# EAGLE design dash-hat (EAGLE 7.7.0)
Assembly variants: Rev A Final Assembly
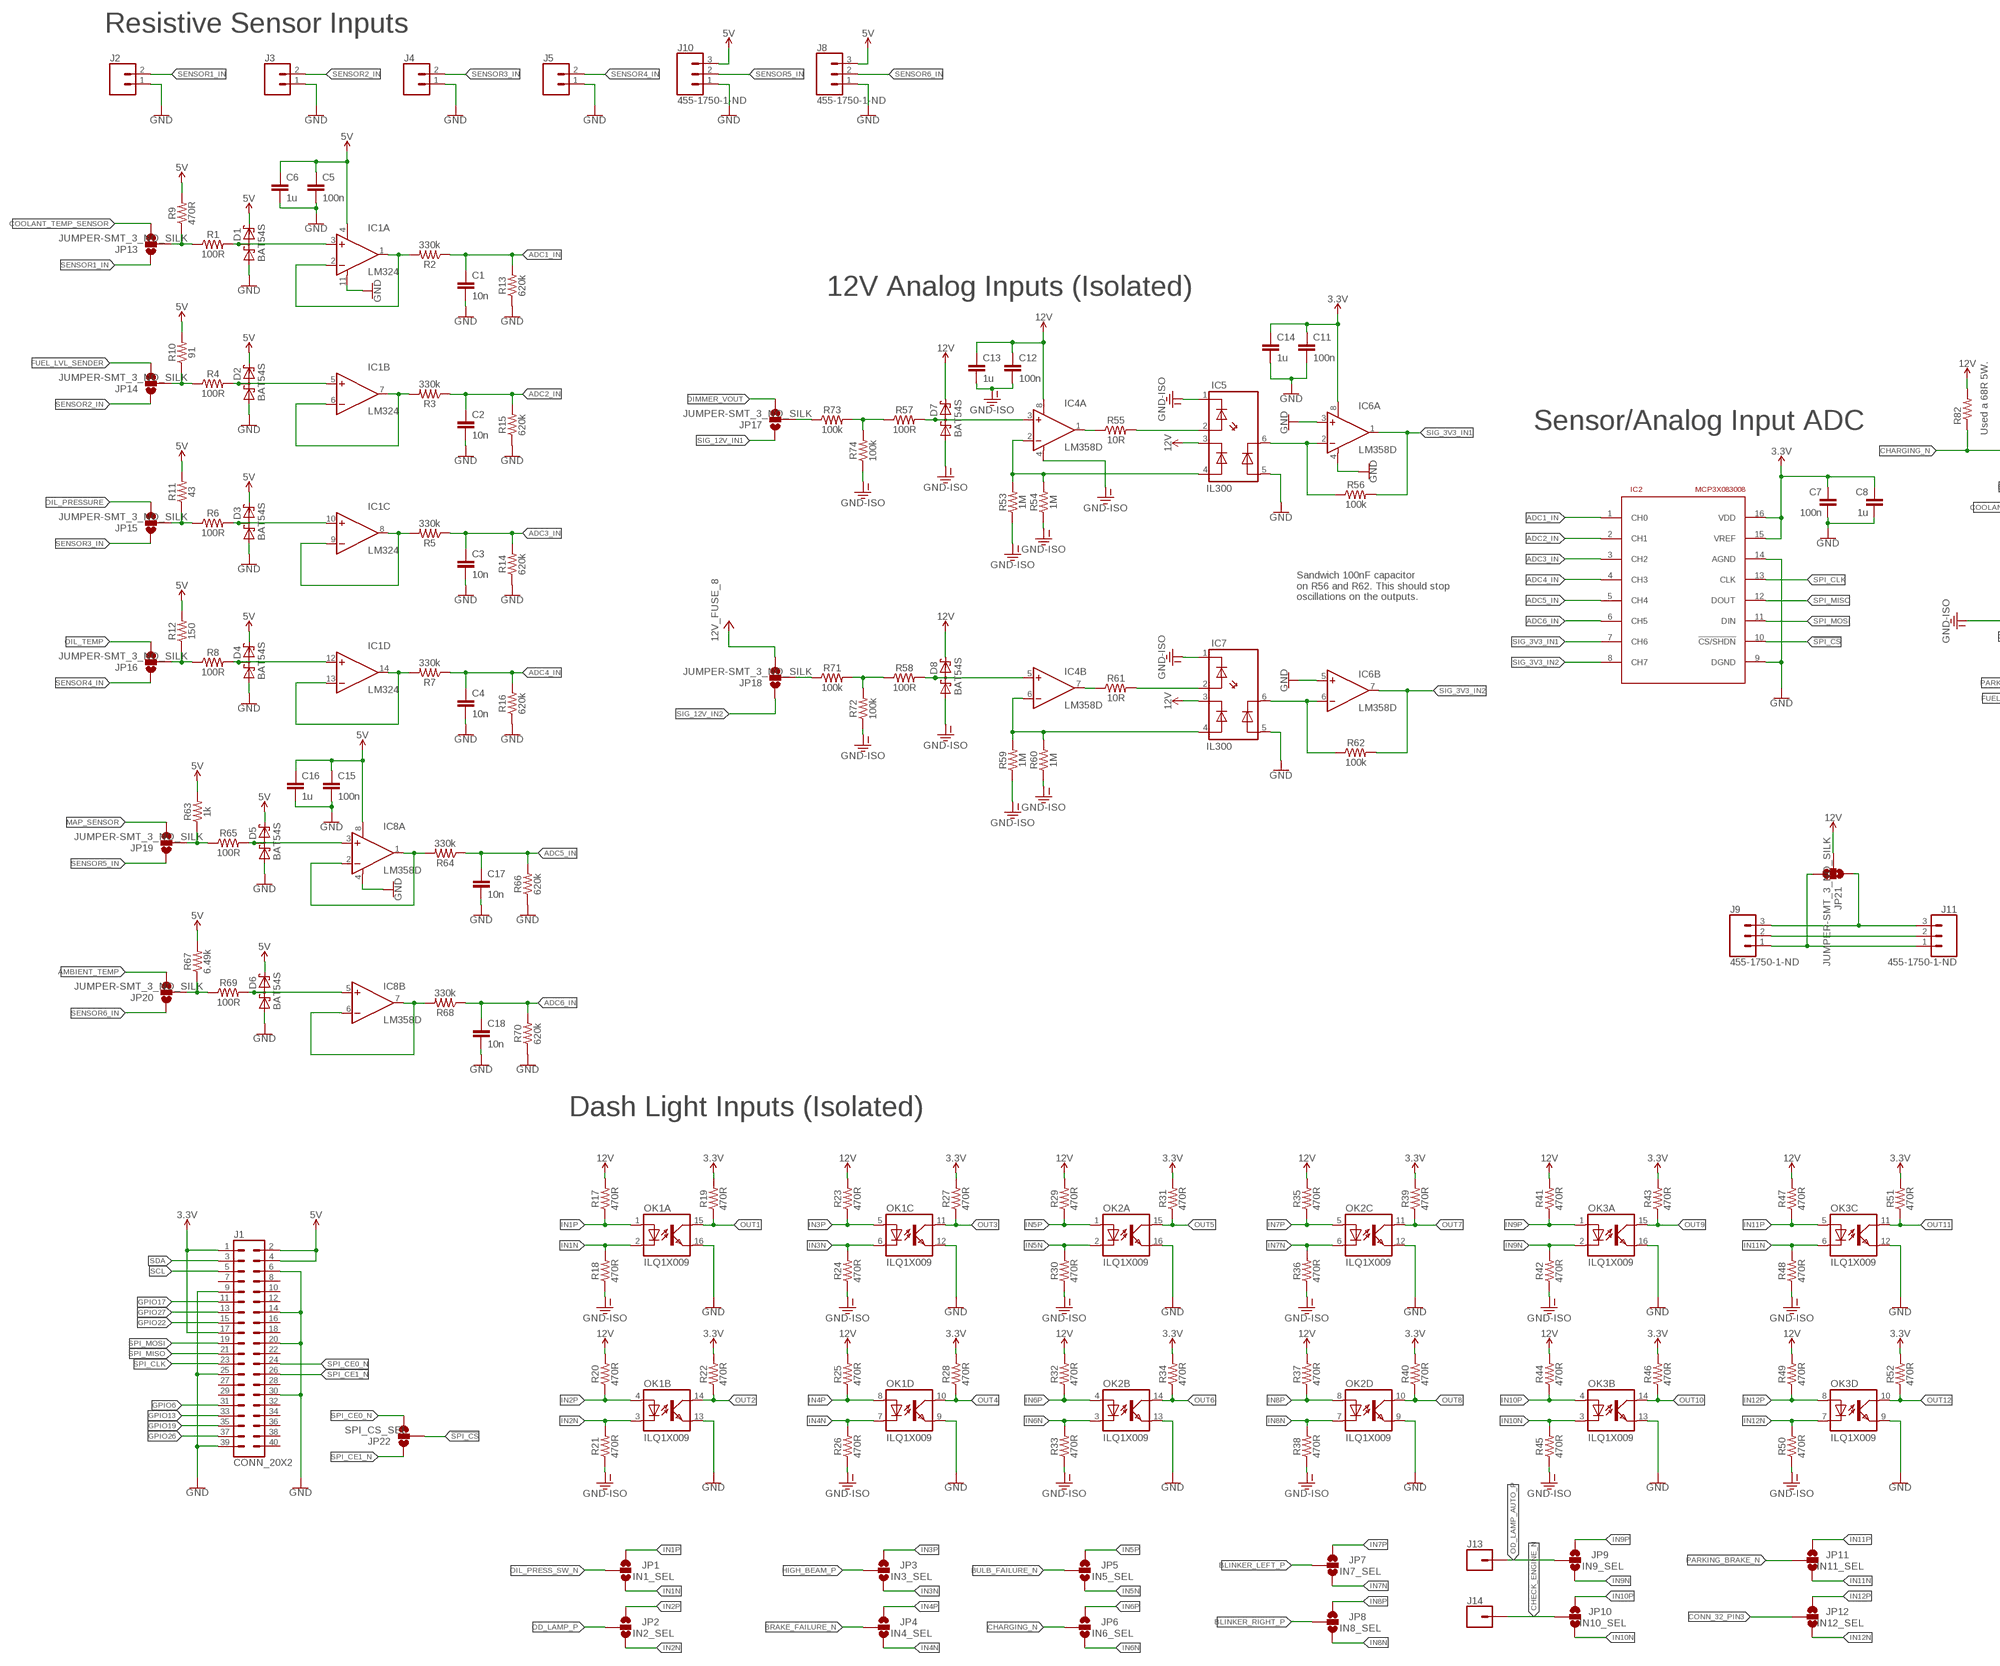
[diagram p0: schematic, sheet 1, part 1 of 2]
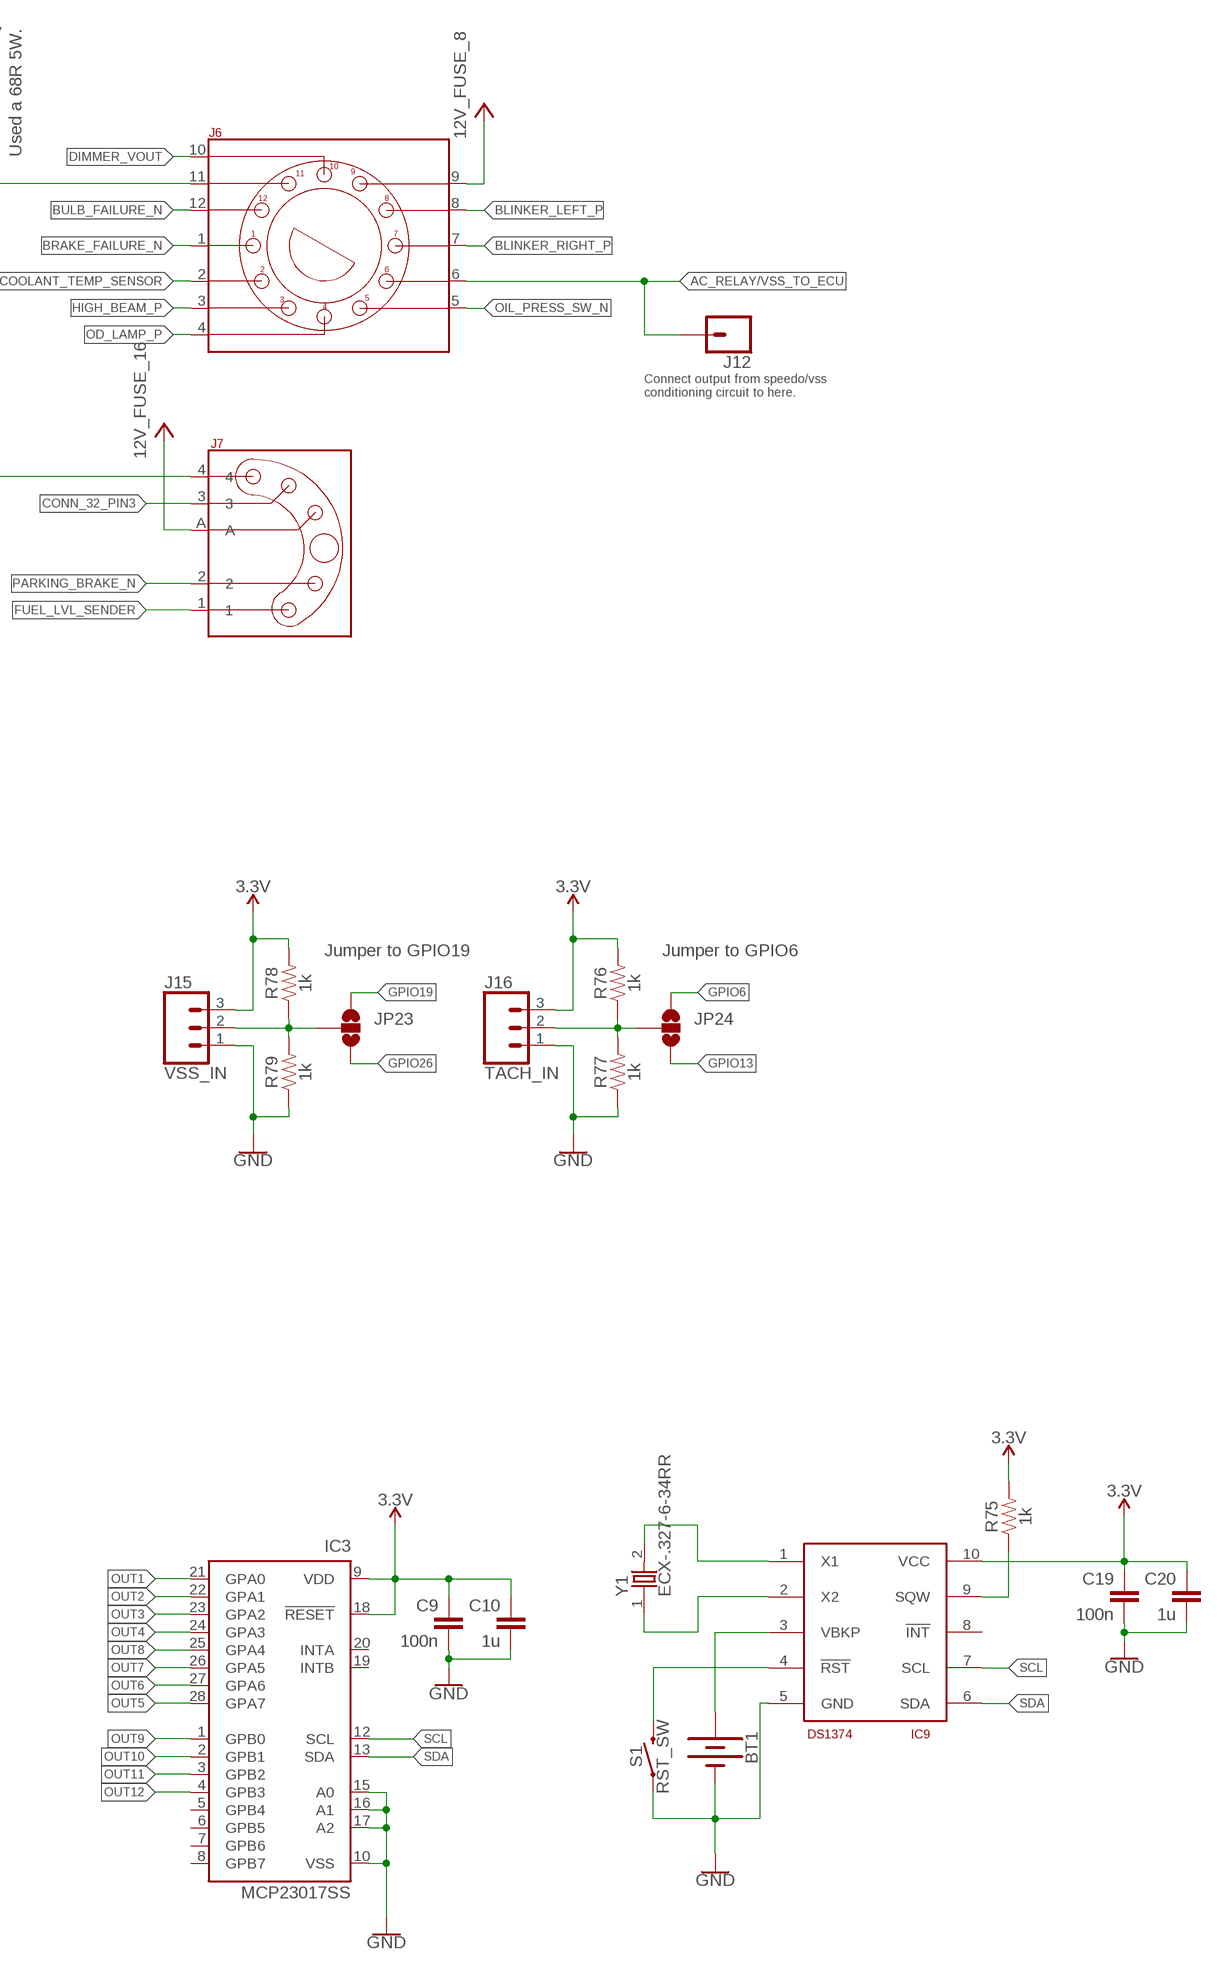
[diagram p1: schematic, sheet 1, part 2 of 2]

## Parts
BT1  BATTERY-12MM_SMD  [BATTCON_12MM]
C1  10n  CL10B103KB8NNNC  [0603]
C2  10n  CL10B103KB8NNNC  [0603]
C3  10n  CL10B103KB8NNNC  [0603]
C4  10n  CL10B103KB8NNNC  [0603]
C5  100n  CL10B104MB8NNNC  [0603]
C6  1u  CL10A105KA8NNNC  [0603]
C7  100n  CL10B104MB8NNNC  [0603]
C8  1u  CL10A105KA8NNNC  [0603]
C9  100n  CL10B104MB8NNNC  [0603]
C10  1u  CL10A105KA8NNNC  [0603]
C11  100n  CL10B104MB8NNNC  [0603]
C12  100n  CL10B104MB8NNNC  [0603]
C13  1u  CL10A105KA8NNNC  [0603]
C14  1u  CL10A105KA8NNNC  [0603]
C15  100n  CL10B104MB8NNNC  [0603]
C16  1u  CL10A105KA8NNNC  [0603]
C17  10n  CL10B103KB8NNNC  [0603]
C18  10n  CL10B103KB8NNNC  [0603]
C19  100n  CL10B104MB8NNNC  [0603]
C20  1u  CL10A105KA8NNNC  [0603]
D1  BAT54S  [SOT23]
D2  BAT54S  [SOT23]
D3  BAT54S  [SOT23]
D4  BAT54S  [SOT23]
D5  BAT54S  [SOT23]
D6  BAT54S  [SOT23]
D7  BAT54S  [SOT23]
D8  BAT54S  [SOT23]
IC1  LM324  [TSSOP14]
IC2  MCP3X083008  [SO16]
IC3  MCP23017SS  [SSOP28]
IC4  LM358D  [SO08]
IC5  IL300  [DIL8-SMD]
IC6  LM358D  [SO08]
IC7  IL300  [DIL8-SMD]
IC8  LM358D  [SO08]
IC9  DS1374  [UMAX10]
J1  CONN_20X2  [2X20]
J2  CONN_02  [1X02]
J3  CONN_02  [1X02]
J4  CONN_02  [1X02]
J5  CONN_02  [1X02]
J6  VOLVO_CONN_31  [VOLVO_CON_31]
J7  VOLVO_CONN_32  [VOLVO_CON_32]
J8  455-1750-1-ND  CONN_03  [1X03]
J9  455-1750-1-ND  CONN_03  [1X03]
J10  455-1750-1-ND  CONN_03  [1X03]
J11  455-1750-1-ND  CONN_03  [1X03]
J12  CONN_01OFFSET  [1X01_OFFSET]
J13  CONN_01PTH_2MM  [1X01_2MM]
J14  CONN_01PTH_2MM  [1X01_2MM]
J15  VSS_IN  CONN_03  [1X03]
J16  TACH_IN  CONN_03  [1X03]
JP1  IN1_SEL  JUMPER-SMT_3_NO_SILK  [SMT-JUMPER_3_NO_SILK]
JP2  IN2_SEL  JUMPER-SMT_3_NO_SILK  [SMT-JUMPER_3_NO_SILK]
JP3  IN3_SEL  JUMPER-SMT_3_NO_SILK  [SMT-JUMPER_3_NO_SILK]
JP4  IN4_SEL  JUMPER-SMT_3_NO_SILK  [SMT-JUMPER_3_NO_SILK]
JP5  IN5_SEL  JUMPER-SMT_3_NO_SILK  [SMT-JUMPER_3_NO_SILK]
JP6  IN6_SEL  JUMPER-SMT_3_NO_SILK  [SMT-JUMPER_3_NO_SILK]
JP7  IN7_SEL  JUMPER-SMT_3_NO_SILK  [SMT-JUMPER_3_NO_SILK]
JP8  IN8_SEL  JUMPER-SMT_3_NO_SILK  [SMT-JUMPER_3_NO_SILK]
JP9  IN9_SEL  JUMPER-SMT_3_NO_SILK  [SMT-JUMPER_3_NO_SILK]
JP10  IN10_SEL  JUMPER-SMT_3_NO_SILK  [SMT-JUMPER_3_NO_SILK]
JP11  IN11_SEL  JUMPER-SMT_3_NO_SILK  [SMT-JUMPER_3_NO_SILK]
JP12  IN12_SEL  JUMPER-SMT_3_NO_SILK  [SMT-JUMPER_3_NO_SILK]
JP13  JUMPER-SMT_3_NO_SILK  [SMT-JUMPER_3_NO_SILK]
JP14  JUMPER-SMT_3_NO_SILK  [SMT-JUMPER_3_NO_SILK]
JP15  JUMPER-SMT_3_NO_SILK  [SMT-JUMPER_3_NO_SILK]
JP16  JUMPER-SMT_3_NO_SILK  [SMT-JUMPER_3_NO_SILK]
JP17  JUMPER-SMT_3_NO_SILK  [SMT-JUMPER_3_NO_SILK]
JP18  JUMPER-SMT_3_NO_SILK  [SMT-JUMPER_3_NO_SILK]
JP19  JUMPER-SMT_3_NO_SILK  [SMT-JUMPER_3_NO_SILK]
JP20  JUMPER-SMT_3_NO_SILK  [SMT-JUMPER_3_NO_SILK]
JP21  JUMPER-SMT_3_NO_SILK  [SMT-JUMPER_3_NO_SILK]
JP22  SPI_CS_SEL  JUMPER-SMT_3_NO_SILK  [SMT-JUMPER_3_NO_SILK]
JP23  TACH_INPUT_SEL  JUMPER-SMT_3_NO_SILK  [SMT-JUMPER_3_NO_SILK]
JP24  TACH_INPUT_SEL  JUMPER-SMT_3_NO_SILK  [SMT-JUMPER_3_NO_SILK]
OK1  ILQ1X009  [SMD16]
OK2  ILQ1X009  [SMD16]
OK3  ILQ1X009  [SMD16]
R1  100R  RC0603JR-07100RL  [0603]
R2  330k  RC0603JR-07330KL  [0603]
R3  330k  RC0603JR-07330KL  [0603]
R4  100R  RC0603JR-07100RL  [0603]
R5  330k  RC0603JR-07330KL  [0603]
R6  100R  RC0603JR-07100RL  [0603]
R7  330k  RC0603JR-07330KL  [0603]
R8  100R  RC0603JR-07100RL  [0603]
R9  470R  RC0603JR-07470RL  [0603]
R10  91  RC0603JR-071KL  [0603]
R11  43  RC0603JR-071KL  [0603]
R12  150  RC0603JR-071KL  [0603]
R13  620k  RC0603JR-07620KL  [0603]
R14  620k  RC0603JR-07620KL  [0603]
R15  620k  RC0603JR-07620KL  [0603]
R16  620k  RC0603JR-07620KL  [0603]
R17  470R  RC0603JR-07470RL  [0603]
R18  470R  RC0603JR-07470RL  [0603]  (not fitted in variant Rev A Final Assembly)
R19  470R  RC0603JR-07470RL  [0603]
R20  470R  RC0603JR-07470RL  [0603]  (not fitted in variant Rev A Final Assembly)
R21  470R  RC0603JR-07470RL  [0603]
R22  470R  RC0603JR-07470RL  [0603]
R23  470R  RC0603JR-07470RL  [0603]  (not fitted in variant Rev A Final Assembly)
R24  470R  RC0603JR-07470RL  [0603]
R25  470R  RC0603JR-07470RL  [0603]
R26  470R  RC0603JR-07470RL  [0603]  (not fitted in variant Rev A Final Assembly)
R27  470R  RC0603JR-07470RL  [0603]
R28  470R  RC0603JR-07470RL  [0603]
R29  470R  RC0603JR-07470RL  [0603]
R30  470R  RC0603JR-07470RL  [0603]  (not fitted in variant Rev A Final Assembly)
R31  470R  RC0603JR-07470RL  [0603]
R32  470R  RC0603JR-07470RL  [0603]
R33  470R  RC0603JR-07470RL  [0603]  (not fitted in variant Rev A Final Assembly)
R34  470R  RC0603JR-07470RL  [0603]
R35  470R  RC0603JR-07470RL  [0603]  (not fitted in variant Rev A Final Assembly)
R36  470R  RC0603JR-07470RL  [0603]
R37  470R  RC0603JR-07470RL  [0603]  (not fitted in variant Rev A Final Assembly)
R38  470R  RC0603JR-07470RL  [0603]
R39  470R  RC0603JR-07470RL  [0603]
R40  470R  RC0603JR-07470RL  [0603]
R41  470R  RC0603JR-07470RL  [0603]
R42  470R  RC0603JR-07470RL  [0603]
R43  470R  RC0603JR-07470RL  [0603]
R44  470R  RC0603JR-07470RL  [0603]
R45  470R  RC0603JR-07470RL  [0603]  (not fitted in variant Rev A Final Assembly)
R46  470R  RC0603JR-07470RL  [0603]
R47  470R  RC0603JR-07470RL  [0603]
R48  470R  RC0603JR-07470RL  [0603]  (not fitted in variant Rev A Final Assembly)
R49  470R  RC0603JR-07470RL  [0603]
R50  470R  RC0603JR-07470RL  [0603]
R51  470R  RC0603JR-07470RL  [0603]
R52  470R  RC0603JR-07470RL  [0603]
R53  1M  RC0603JR-071ML  [0603]
R54  1M  RC0603JR-071ML  [0603]
R55  10R  RC0603JR-1310RL  [0603]
R56  100k  RC0603JR-07100KL  [0603]
R57  100R  RC0603JR-07100RL  [0603]
R58  100R  RC0603JR-07100RL  [0603]
R59  1M  RC0603JR-071ML  [0603]
R60  1M  RC0603JR-071ML  [0603]
R61  10R  RC0603JR-1310RL  [0603]
R62  100k  RC0603JR-07100KL  [0603]
R63  1k  RC0603JR-071KL  [0603]  (not fitted in variant Rev A Final Assembly)
R64  330k  RC0603JR-07330KL  [0603]
R65  100R  RC0603JR-07100RL  [0603]
R66  620k  RC0603JR-07620KL  [0603]
R67  6.49k  RC0603JR-071KL  [0603]
R68  330k  RC0603JR-07330KL  [0603]
R69  100R  RC0603JR-07100RL  [0603]
R70  620k  RC0603JR-07620KL  [0603]
R71  100k  RC0603JR-07100KL  [0603]
R72  100k  RC0603JR-07100KL  [0603]
R73  100k  RC0603JR-07100KL  [0603]
R74  100k  RC0603JR-07100KL  [0603]
R75  1k  RC0603JR-071KL  [0603]
R76  1k  RC0603JR-071KL  [0603]
R77  1k  RC0603JR-071KL  [0603]  (not fitted in variant Rev A Final Assembly)
R78  1k  RC0603JR-071KL  [0603]
R79  1k  RC0603JR-071KL  [0603]  (not fitted in variant Rev A Final Assembly)
R82  R-US_0617/17  [0617/17]
S1  RST_SW  MOMENTARY-SWITCH-SPST-SMD-6.0X3.5MM  [TACTILE_SWITCH_SMD_6.0X3.5MM]  (not fitted in variant Rev A Final Assembly)
Y1  ECX-.327-6-34RR  [ECX-34RR]

## Nets
3.3V: C7.1 C8.1 C9.1 C10.1 C11.1 C14.1 C19.1 C20.1 IC2.15(VREF) IC2.16(VDD) IC3.9(VDD) IC3.18(!RESET) IC6.8(A:V+) IC9.10(VCC) J1.1 J1.17 J15.3 J16.3 R19.2 R22.2 R27.2 R28.2 R31.2 R34.2 R39.2 R40.2 R43.2 R46.2 R51.2 R52.2 R75.2 R76.2 R78.2
5V: C5.1 C6.1 C15.1 C16.1 D1.2(C2) D2.2(C2) D3.2(C2) D4.2(C2) D5.2(C2) D6.2(C2) IC1.4(A:V+) IC8.8(A:V+) J1.2 J1.4 J8.3 J10.3 R9.2 R10.2 R11.2 R12.2 R63.2 R67.2
12V: C12.1 C13.1 D7.2(C2) D8.2(C2) IC4.8(A:V+) IC5.3(C3) IC7.3(C3) JP21.2 R17.2 R20.2 R23.2 R25.2 R29.2 R32.2 R35.2 R37.2 R41.2 R44.2 R47.2 R49.2 R82.2
12V-FUSE_8: J6.9 JP18.3 ; supply symbol labelled 12V_FUSE_8
12V-FUSE_16: J7.A ; supply symbol labelled 12V_FUSE_16
!SPI_CS: IC2.10(!CS/SHDN) JP22.2
AC_RELAY/VSS_TO_ECU: J6.6 J12.1
ADC1_IN: C1.1 IC2.1(CH0) R2.1 R13.2
ADC2_IN: C2.1 IC2.2(CH1) R3.1 R15.2
ADC3_IN: C3.1 IC2.3(CH2) R5.1 R14.2
ADC4_IN: C4.1 IC2.4(CH3) R7.1 R16.2
ADC5_IN: C17.1 IC2.5(CH4) R64.1 R66.2
ADC6_IN: C18.1 IC2.6(CH5) R68.1 R70.2
AMBIENT_TEMP: JP20.3
BLINKER_LEFT_P: J6.8 JP7.2
BLINKER_RIGHT_P: J6.7 JP8.2
BRAKE_FAILURE_N: J6.1 JP4.2
BULB_FAILURE_N: J6.12 JP5.2
CHARGING_N: J6.11 JP6.2 R82.1
CHECK_ENGINE_N: J14.1 JP10.2
CONN_32_PIN3: J7.3 JP12.2
COOLANT_TEMP_SENSOR: J6.2 JP13.3
DIMMER_VOUT: J6.10 JP17.3
FUEL_LVL_SENDER: J7.1 JP14.3
GND: BT1.GND(-) C1.2 C2.2 C3.2 C4.2 C5.2 C6.2 C7.2 C8.2 C9.2 C10.2 C11.2 C14.2 C15.2 C16.2 C17.2 C18.2 C19.2 C20.2 D1.1(A1) D2.1(A1) D3.1(A1) D4.1(A1) D5.1(A1) D6.1(A1) IC1.11(A:V-) IC2.9(DGND) IC2.14(AGND) IC3.10(VSS) IC3.15(A0) IC3.16(A1) IC3.17(A2) IC5.5(A5) IC6.3(A:+IN) IC6.4(A:V-) IC6.5(B:+IN) IC7.5(A5) IC8.4(A:V-) IC9.5(GND) J1.6 J1.9 J1.14 J1.20 J1.25 J1.30 J1.39 J2.1 J3.1 J4.1 J5.1 J8.1 J10.1 J15.1 J16.1 OK1.9(D:EMIT) OK1.12(C:EMIT) OK1.13(B:EMIT) OK1.16(A:EMIT) OK2.9(D:EMIT) OK2.12(C:EMIT) OK2.13(B:EMIT) OK2.16(A:EMIT) OK3.9(D:EMIT) OK3.12(C:EMIT) OK3.13(B:EMIT) OK3.16(A:EMIT) R13.1 R14.1 R15.1 R16.1 R66.1 R70.1 R77.1 R79.1 S1.1
GND-ISO: C12.2 C13.2 D7.1(A1) D8.1(A1) IC4.4(A:V-) IC5.1(C1) IC7.1(C1) J7.4 R18.1 R21.1 R24.1 R26.1 R30.1 R33.1 R36.1 R38.1 R42.1 R45.1 R48.1 R50.1 R53.1 R54.1 R59.1 R60.1 R72.1 R74.1
GPIO6: J1.31 JP24.1
GPIO13: J1.33 JP24.3
GPIO17: J1.11
GPIO19: J1.35 JP23.1
GPIO22: J1.15
GPIO26: J1.37 JP23.3
GPIO27: J1.13
HIGH_BEAM_P: J6.3 JP3.2
IN1_12V_SIGNAL: R57.1 R73.2 R74.2
IN1N: JP1.3 OK1.2(A:C) R18.2
IN1P: JP1.1 OK1.1(A:A) R17.1
IN2N: JP2.3 OK1.3(B:C) R21.2
IN2P: JP2.1 OK1.4(B:A) R20.1
IN3N: JP3.3 OK1.6(C:C) R24.2
IN3P: JP3.1 OK1.5(C:A) R23.1
IN4N: JP4.3 OK1.7(D:C) R26.2
IN4P: JP4.1 OK1.8(D:A) R25.1
IN5N: JP5.3 OK2.2(A:C) R30.2
IN5P: JP5.1 OK2.1(A:A) R29.1
IN6N: JP6.3 OK2.3(B:C) R33.2
IN6P: JP6.1 OK2.4(B:A) R32.1
IN7N: JP7.3 OK2.6(C:C) R36.2
IN7P: JP7.1 OK2.5(C:A) R35.1
IN8N: JP8.3 OK2.7(D:C) R38.2
IN8P: JP8.1 OK2.8(D:A) R37.1
IN9N: JP9.3 OK3.2(A:C) R42.2
IN9P: JP9.1 OK3.1(A:A) R41.1
IN10N: JP10.3 OK3.3(B:C) R45.2
IN10P: JP10.1 OK3.4(B:A) R44.1
IN11N: JP11.3 OK3.6(C:C) R48.2
IN11P: JP11.1 OK3.5(C:A) R47.1
IN12N: JP12.3 OK3.7(D:C) R50.2
IN12P: JP12.1 OK3.8(D:A) R49.1
MAP_SENSOR: JP19.3
N$1: IC1.1(A:OUT) IC1.2(A:-IN) R2.2
N$2: D7.3(C1A2) IC4.3(A:+IN) R57.2
N$3: D1.3(C1A2) IC1.3(A:+IN) R1.2
N$4: IC4.2(A:-IN) IC5.4(A4) R53.2 R54.2
N$5: IC1.6(B:-IN) IC1.7(B:OUT) R3.2
N$6: D8.3(C1A2) IC4.5(B:+IN) R58.2
N$7: D2.3(C1A2) IC1.5(B:+IN) R4.2
N$8: IC4.6(B:-IN) IC7.4(A4) R59.2 R60.2
N$9: IC1.8(C:OUT) IC1.9(C:-IN) R5.2
N$10: J9.1 J11.1 JP21.3
N$11: D3.3(C1A2) IC1.10(C:+IN) R6.2
N$12: J9.2 J11.2
N$13: IC1.13(D:-IN) IC1.14(D:OUT) R7.2
N$14: J9.3 J11.3 JP21.1
N$15: D4.3(C1A2) IC1.12(D:+IN) R8.2
N$16: JP13.2 R1.1 R9.1
N$17: R58.1 R71.2 R72.2
N$18: IC5.6(C6) IC6.2(A:-IN) R56.1
N$19: JP18.2 R71.1
N$20: IC4.1(A:OUT) R55.1
N$21: IC4.7(B:OUT) R61.1
N$22: JP14.2 R4.1 R10.1
N$23: JP17.2 R73.1
N$24: IC9.1(X1) Y1.2
N$25: IC5.2(A2) R55.2
N$26: IC7.2(A2) R61.2
N$27: IC6.6(B:-IN) IC7.6(C6) R62.1
N$28: IC8.1(A:OUT) IC8.2(A:-IN) R64.2
N$29: D5.3(C1A2) IC8.3(A:+IN) R65.2
N$30: JP15.2 R6.1 R11.1
N$31: JP16.2 R8.1 R12.1
N$32: IC9.2(X2) Y1.1
N$33: J15.2 JP23.2 R78.1 R79.2
N$34: JP19.2 R63.1 R65.1
N$35: IC8.6(B:-IN) IC8.7(B:OUT) R68.2
N$36: D6.3(C1A2) IC8.5(B:+IN) R69.2
N$37: JP20.2 R67.1 R69.1
N$38: BT1.PWR@1(+) IC9.3(VBKP)
N$39: IC9.9(SQW) R75.1
N$41: IC9.4(!RST) S1.2
N$43: J16.2 JP24.2 R76.1 R77.2
OD_LAMP_AUTO_P: J13.1 JP9.2
OD_LAMP_P: J6.4 JP2.2
OIL_PRESS_SW_N: J6.5 JP1.2
OIL_PRESSURE: JP15.3
OIL_TEMP: JP16.3
OUT1: IC3.21(GPA0) OK1.15(A:COL) R19.1
OUT2: IC3.22(GPA1) OK1.14(B:COL) R22.1
OUT3: IC3.23(GPA2) OK1.11(C:COL) R27.1
OUT4: IC3.24(GPA3) OK1.10(D:COL) R28.1
OUT5: IC3.28(GPA7) OK2.15(A:COL) R31.1
OUT6: IC3.27(GPA6) OK2.14(B:COL) R34.1
OUT7: IC3.26(GPA5) OK2.11(C:COL) R39.1
OUT8: IC3.25(GPA4) OK2.10(D:COL) R40.1
OUT9: IC3.1(GPB0) OK3.15(A:COL) R43.1
OUT10: IC3.2(GPB1) OK3.14(B:COL) R46.1
OUT11: IC3.3(GPB2) OK3.11(C:COL) R51.1
OUT12: IC3.4(GPB3) OK3.10(D:COL) R52.1
PARKING_BRAKE_N: J7.2 JP11.2
SCL: IC3.12(SCL) IC9.7(SCL) J1.5
SDA: IC3.13(SDA) IC9.6(SDA) J1.3
SENSOR1_IN: J2.2 JP13.1
SENSOR2_IN: J3.2 JP14.1
SENSOR3_IN: J4.2 JP15.1
SENSOR4_IN: J5.2 JP16.1
SENSOR5_IN: J10.2 JP19.1
SENSOR6_IN: J8.2 JP20.1
SIG_3V3_IN1: IC2.7(CH6) IC6.1(A:OUT) R56.2
SIG_3V3_IN2: IC2.8(CH7) IC6.7(B:OUT) R62.2
SIG_12V_IN1: JP17.1
SIG_12V_IN2: JP18.1
SPI_CE0_N: J1.24 JP22.3
SPI_CE1_N: J1.26 JP22.1
SPI_CLK: IC2.13(CLK) J1.23
SPI_MISO: IC2.12(DOUT) J1.21
SPI_MOSI: IC2.11(DIN) J1.19
Unconnected: IC3.5(GPB4) IC3.6(GPB5) IC3.7(GPB6) IC3.8(GPB7) IC3.19(INTB) IC3.20(INTA) IC9.8(!INT) J1.7 J1.8 J1.10 J1.12 J1.16 J1.18 J1.22 J1.27 J1.28 J1.29 J1.32 J1.34 J1.36 J1.38 J1.40

## Notes on the sheet
- Resistive Sensor Inputs
- 12V Analog Inputs (Isolated)
- Sensor/Analog Input ADC
- Used a 68R 5W.
- Connect output from speedo/vss 
  conditioning circuit to here.
- Sandwich 100nF capacitor
  on R56 and R62. This should stop
  oscillations on the outputs.
- Jumper to GPIO19 | Jumper to GPIO6
- Dash Light Inputs (Isolated)

## Library data of the parts
BT1 = SparkFun-Batteries:BATTERY: Battery - Single Cell A variety of battery chemistries, sizes, and footprints. Device List: 20MM_PTH - Coin Cell Battery Holder - 20mm (PTH) <https://www.sparkfun.com/products/783> 20MM_PTH_KIT- Coin Cell battery Holder - 20 mm (PTH) <http://www.sparkfun.com/products/783>kit version with special mask 6.8MM_PTH - Coin Cell Battery Holder - 6.8MM(SMD) <https://www.digikey.com/product-detail/en/seiko-instruments/MS621FE-FL11E/728-1057-ND/1889208?WT.srch=1&gclid=CNOQ5a6LzdQCFZS2wAodXCkE0g> 12MM_SMD - Coin Cell Battery Holder - 12mm (SMD) <https://www.sparkfun.com/products/10592> 12MM_PTH - Coin Cell Battery Holder - 12mm (PTH) <https://www.sparkfun.com/products/7948> 20MM_SMD - 20mm Coin Cell Battery Holder (SMD) (2 legs) Used on the Big Time Watch Kit <https://www.sparkfun.com/products/11734> 20MM_SMD_4LEGS - Coin Cell Battery Holder - 20mm (SMD) <https://www.sparkfun.com/products/11892> 20MM_SMD_4LEGS_OVERPASTE - Coin Cell Battery Holder - 20mm (SMD) <https://www.sparkfun.com/products/11892> (Over-paste on the legs) 24.5MM_PTH - Coin Cell Battery Holder - 24.5mm (PTH) <https://www.sparkfun.com/products/8863> 9V - 9V Battery Holder - PC Mount Used on the SparkFun SparkPunk Sound Kit <https://www.sparkfun.com/products/11177> and SparkFun SparkPunk Sequencer Kit <https://www.sparkfun.com/products/12707> 18650 - Battery Holder - 18650 (PTH) <https://www.sparkfun.com/products/13113> AA - Battery Holder - 1xAA (PTH) <https://www.sparkfun.com/products/7949> AAA - Battery Holder - 1xAAA (PTH) <https://www.sparkfun.com/products/12718> AA_KIT - Battery Holder - 1xAA (PTH) <https://www.sparkfun.com/products/7949> Special kit package - pads only have exposed copper on one side of the board. AAA_KIT - Battery Holder - 1xAAA (PTH) <https://www.sparkfun.com/products/12718> Special kit package - pads only have exposed copper on one side of the board.; PROD_ID: BATT-08044; SF_SKU: PRT-10592
C1-C20 = digital_dash:CL
D1-D8 = diode:BAT54S: Schottky Diodes Pin connection corrected 2011-05-04 Source: Fairchild .. BAT54.pdf
IC1 = digital_dash:LM324
IC2 = digital_dash:MCP3X08
IC3 = microchip:MCP23017: http://ww1.microchip.com/downloads/en/DeviceDoc/21952a.pdf Source: http://ww1.microchip.com/downloads/en/DeviceDoc/21952a.pdf; MF: MICROCHIP; MPN: MCP23017-E/SS; OC_FARNELL: 1467674; OC_NEWARK: 31K2960
IC4 IC6 IC8 = digital_dash:LM358: OP AMP also LM158; LM258; LM2904 Source: http://cache.national.com/ds/LM/LM158.pdf
IC5 IC7 = digital_dash:IL300
IC9 = digital_dash:DS1374
J1 = SparkFun-Connectors:CONN_20X2: Multi connection point. Often used as Generic Header-pin footprint for 0.1 inch spaced/style header connections On any of the 0.1 inch spaced packages, you can populate with these: Break Away Headers - Straight <https://www.sparkfun.com/products/116> (PRT-00116) Break Away Male Headers - Right Angle <https://www.sparkfun.com/products/553> (PRT-00553) Female Headers <https://www.sparkfun.com/products/115> (PRT-00115) Break Away Headers - Machine Pin <https://www.sparkfun.com/products/117> (PRT-00117) Break Away Female Headers - Swiss Machine Pin <https://www.sparkfun.com/products/743> (PRT-00743)
J2-J5 = SparkFun-Connectors:CONN_02: Multi connection point. Often used as Generic Header-pin footprint for 0.1 inch spaced/style header connections On any of the 0.1 inch spaced packages, you can populate with these: Break Away Headers - Straight <https://www.sparkfun.com/products/116> (PRT-00116) Break Away Male Headers - Right Angle <https://www.sparkfun.com/products/553> (PRT-00553) Female Headers <https://www.sparkfun.com/products/115> (PRT-00115) Break Away Headers - Machine Pin <https://www.sparkfun.com/products/117> (PRT-00117) Break Away Female Headers - Swiss Machine Pin <https://www.sparkfun.com/products/743> (PRT-00743) For SCREWTERMINALS and SPRING TERMINALS visit here: Screw Terimnals on SparkFun.com <https://www.sparkfun.com/search/results?term=Screw+Terminals> (5mm/3.5mm/2.54mm spacing) This device is also useful as a general connection point to wire up your design to another part of your project. Our various solder wires solder well into these plated through hole pads. Hook-Up Wire - Assortment (Stranded, 22 AWG) <https://www.sparkfun.com/products/11375> (PRT-11375) Hook-Up Wire - Assortment (Solid Core, 22 AWG) <https://www.sparkfun.com/products/11367> (PRT-11367) View the entire wire category on our website here <https://www.sparkfun.com/categories/141> Special notes: Molex polarized connector foot print use with: PRT-08233 with associated crimp pins and housings. 2.54_SCREWTERM for use with PRT-10571. 3.5mm Screw Terminal footprints for PRT-08084 5mm Screw Terminal footprints for use with PRT-08432
J6 = digital_dash:VOLVO_CONN_31
J7 = digital_dash:VOLVO_CONN_32
J8-J11 = SparkFun-Connectors:CONN_03: Multi connection point. Often used as Generic Header-pin footprint for 0.1 inch spaced/style header connections On any of the 0.1 inch spaced packages, you can populate with these: Break Away Headers - Straight <https://www.sparkfun.com/products/116> (PRT-00116) Break Away Male Headers - Right Angle <https://www.sparkfun.com/products/553> (PRT-00553) Female Headers <https://www.sparkfun.com/products/115> (PRT-00115) Break Away Headers - Machine Pin <https://www.sparkfun.com/products/117> (PRT-00117) Break Away Female Headers - Swiss Machine Pin <https://www.sparkfun.com/products/743> (PRT-00743) Stackable Header - 3 Pin (Female, 0.1") <https://www.sparkfun.com/products/13875> (PRT-13875) For SCREWTERMINALS and SPRING TERMINALS visit here: Screw Terimnals on SparkFun.com <https://www.sparkfun.com/search/results?term=Screw+Terminals> (5mm/3.5mm/2.54mm spacing) This device is also useful as a general connection point to wire up your design to another part of your project. Our various solder wires solder well into these plated through hole pads. Hook-Up Wire - Assortment (Stranded, 22 AWG) <https://www.sparkfun.com/products/11375> (PRT-11375) Hook-Up Wire - Assortment (Solid Core, 22 AWG) <https://www.sparkfun.com/products/11367> (PRT-11367) View the entire wire category on our website here <https://www.sparkfun.com/categories/141> Special notes: Molex polarized connector foot print use with SKU : PRT-08232 with associated crimp pins and housings.; PROD_ID: XXX-00000
J12-J14 = SparkFun-Connectors:CONN_01: Single connection point. Often used as Generic Header-pin footprint for 0.1 inch spaced/style header connections On any of the 0.1 inch spaced packages, you can populate with these: Break Away Headers - Straight <https://www.sparkfun.com/products/116> (PRT-00116) Break Away Male Headers - Right Angle <https://www.sparkfun.com/products/553> (PRT-00553) Female Headers <https://www.sparkfun.com/products/115> (PRT-00115) Break Away Headers - Machine Pin <https://www.sparkfun.com/products/117> (PRT-00117) Break Away Female Headers - Swiss Machine Pin <https://www.sparkfun.com/products/743> (PRT-00743) This device is also useful as a general connection point to wire up your design to another part of your project. Our various solder wires solder well into these plated through hole pads. Hook-Up Wire - Assortment (Stranded, 22 AWG) <https://www.sparkfun.com/products/11375> (PRT-11375) Hook-Up Wire - Assortment (Solid Core, 22 AWG) <https://www.sparkfun.com/products/11367> (PRT-11367) View the entire wire category on our website here <https://www.sparkfun.com/categories/141> Special notes: SMTSO-256-ET is a "flush mount" nut for a 4-40 screw. We mostly use this on specialty testbeds; it is a nice way to connect hardware to your PCB at an adjustable hieght. Also note, the SNAP packages are for using a snappable style connector. We sell a baggie of snaps and they are also used on two LilyPad designs: Snap Assortment - 30 pack (male and female) <https://www.sparkfun.com/products/11347> (DEV-11347) LilyPad Arduino SimpleSnap <https://www.sparkfun.com/products/10941> (DEV-10941) LilyPad SimpleSnap Protoboard <https://www.sparkfun.com/products/10940> (DEV-10940)
J15 J16 = SparkFun-Connectors:CONN_03: Multi connection point. Often used as Generic Header-pin footprint for 0.1 inch spaced/style header connections On any of the 0.1 inch spaced packages, you can populate with these: Break Away Headers - Straight <https://www.sparkfun.com/products/116> (PRT-00116) Break Away Male Headers - Right Angle <https://www.sparkfun.com/products/553> (PRT-00553) Female Headers <https://www.sparkfun.com/products/115> (PRT-00115) Break Away Headers - Machine Pin <https://www.sparkfun.com/products/117> (PRT-00117) Break Away Female Headers - Swiss Machine Pin <https://www.sparkfun.com/products/743> (PRT-00743) Stackable Header - 3 Pin (Female, 0.1") <https://www.sparkfun.com/products/13875> (PRT-13875) For SCREWTERMINALS and SPRING TERMINALS visit here: Screw Terimnals on SparkFun.com <https://www.sparkfun.com/search/results?term=Screw+Terminals> (5mm/3.5mm/2.54mm spacing) This device is also useful as a general connection point to wire up your design to another part of your project. Our various solder wires solder well into these plated through hole pads. Hook-Up Wire - Assortment (Stranded, 22 AWG) <https://www.sparkfun.com/products/11375> (PRT-11375) Hook-Up Wire - Assortment (Solid Core, 22 AWG) <https://www.sparkfun.com/products/11367> (PRT-11367) View the entire wire category on our website here <https://www.sparkfun.com/categories/141> Special notes: Molex polarized connector foot print use with SKU : PRT-08232 with associated crimp pins and housings.; PROD_ID: XXX-00000; VALUE: 455-1750-1-ND
JP1-JP24 = SparkFun-Jumpers:JUMPER-SMT_3_NO: Normally open jumper This jumper has three pads in close proximity to each other. Apply solder to close the connection(s).
OK1-OK3 = digital_dash:ILQ1: SIEMENS OPTO COUPLER
R1-R9 R13-R66 R68-R79 = digital_dash:RC0603JR
R10-R12 R67 = digital_dash:RC0603JR; VALUE: 1k
R82 = resistor:R-US_: RESISTOR, American symbol
S1 = SparkFun-Switches:MOMENTARY-SWITCH-SPST: Momentary Switch (Pushbutton) - SPST Normally-open (NO) SPST momentary switches (buttons, pushbuttons). Variants PTH-12MM - 12mm square, through-hole Momentary Pushbutton Switch - 12mm Square <https://www.sparkfun.com/products/9190> (COM-09190) PTH-6.0MM, PTH-6.0MM-KIT - 6.0mm square, through-hole Mini Pushbutton Switch <https://www.sparkfun.com/products/97> (COM-00097) KIT package intended for soldering kit's - only one side of pads' copper is exposed. PTH-RIGHT-ANGLE-KIT - Right-angle, through-hole Right Angle Tactile Button <https://www.sparkfun.com/products/10791> - Used on SparkFun BigTime Watch Kit <https://www.sparkfun.com/products/11734> SMD-12MM - 12mm square, surface-mount Tactile Button - SMD (12mm) <https://www.sparkfun.com/products/12993> (COM-12993) Used on SparkFun PicoBoard <https://www.sparkfun.com/products/11888> SMD-4.5MM - 4.5mm Square Trackball Switch Used on SparkFun Blackberry Trackballer Breakout <https://www.sparkfun.com/products/13169> SMD-4.6MMX2.8MM - 4.60mm x 2.80mm, surface mount Used on SparkFun Pro Micro - RP2040 <https://www.sparkfun.com/products/17717> SMD-5.2MM, SMD-5.2-REDUNDANT - 5.2mm square, surface-mount Mini Pushbutton Switch - SMD <https://www.sparkfun.com/products/8720> (COM-08720) Used on Arduino Pro Mini <https://www.sparkfun.com/products/11114> REDUNDANT package connects both switch circuits together SMD-6.0X3.5MM - 6.0 x 3.5mm, surface mount Momentary Reset Switch SMD <https://www.sparkfun.com/products/8229> (COM-08229) SMD-6.2MM-TALL - 6.2mm square, surface mount Tactile Button - SMD (6mm) <https://www.sparkfun.com/products/12992> Used on SparkFun Digital Sandbox <https://www.sparkfun.com/products/12651> SMD-RIGHT-ANGLE - Right-angle, surface mount Used on SparkFun Block for Intel® Edison - Arduino <https://www.sparkfun.com/products/13036>; PROD_ID: SWCH-14278; SF_SKU: COM-08229
Y1 = digital_dash:ECX

## Board
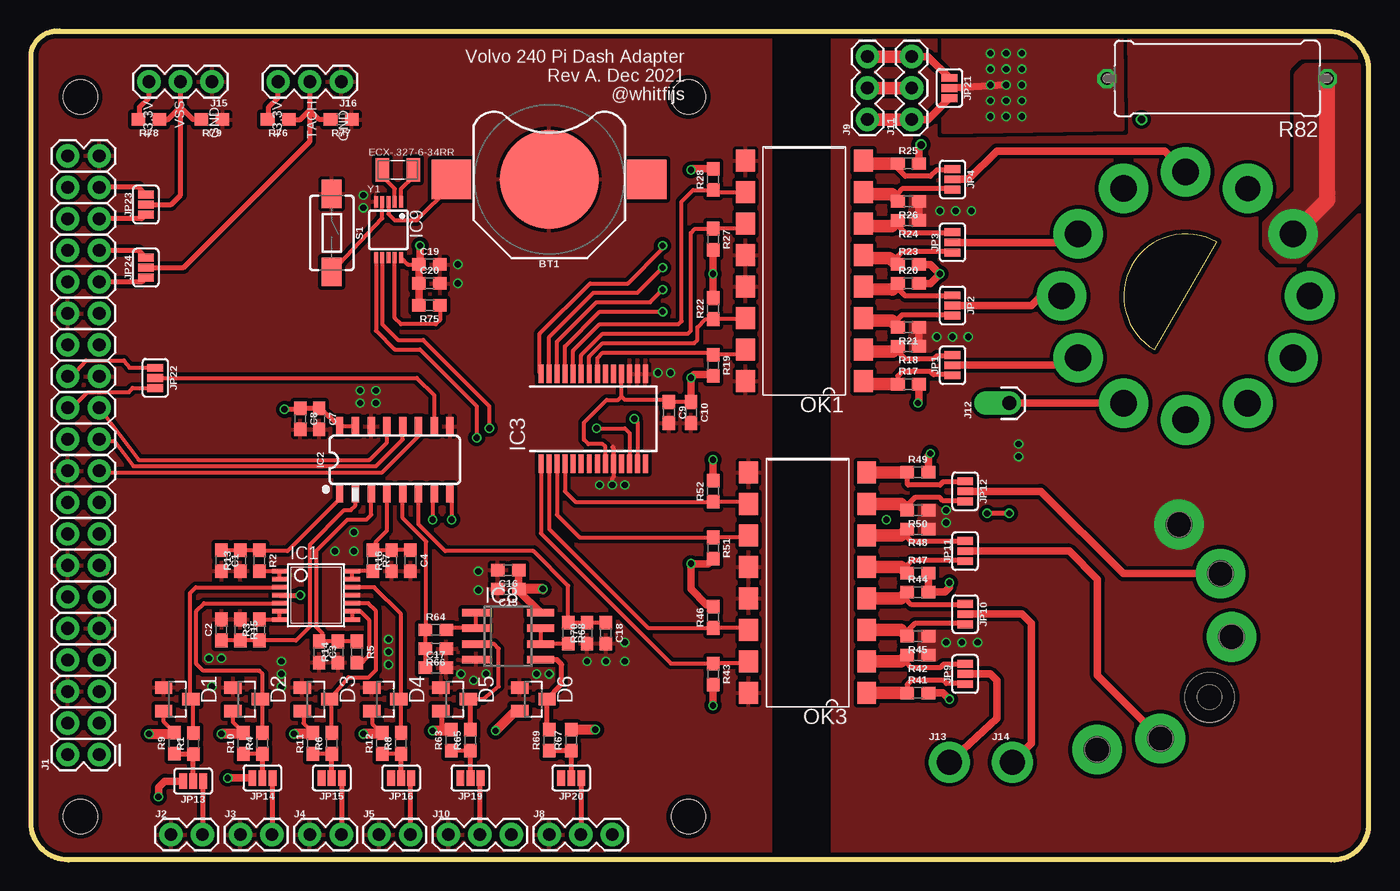
[diagram p2: board, top side]
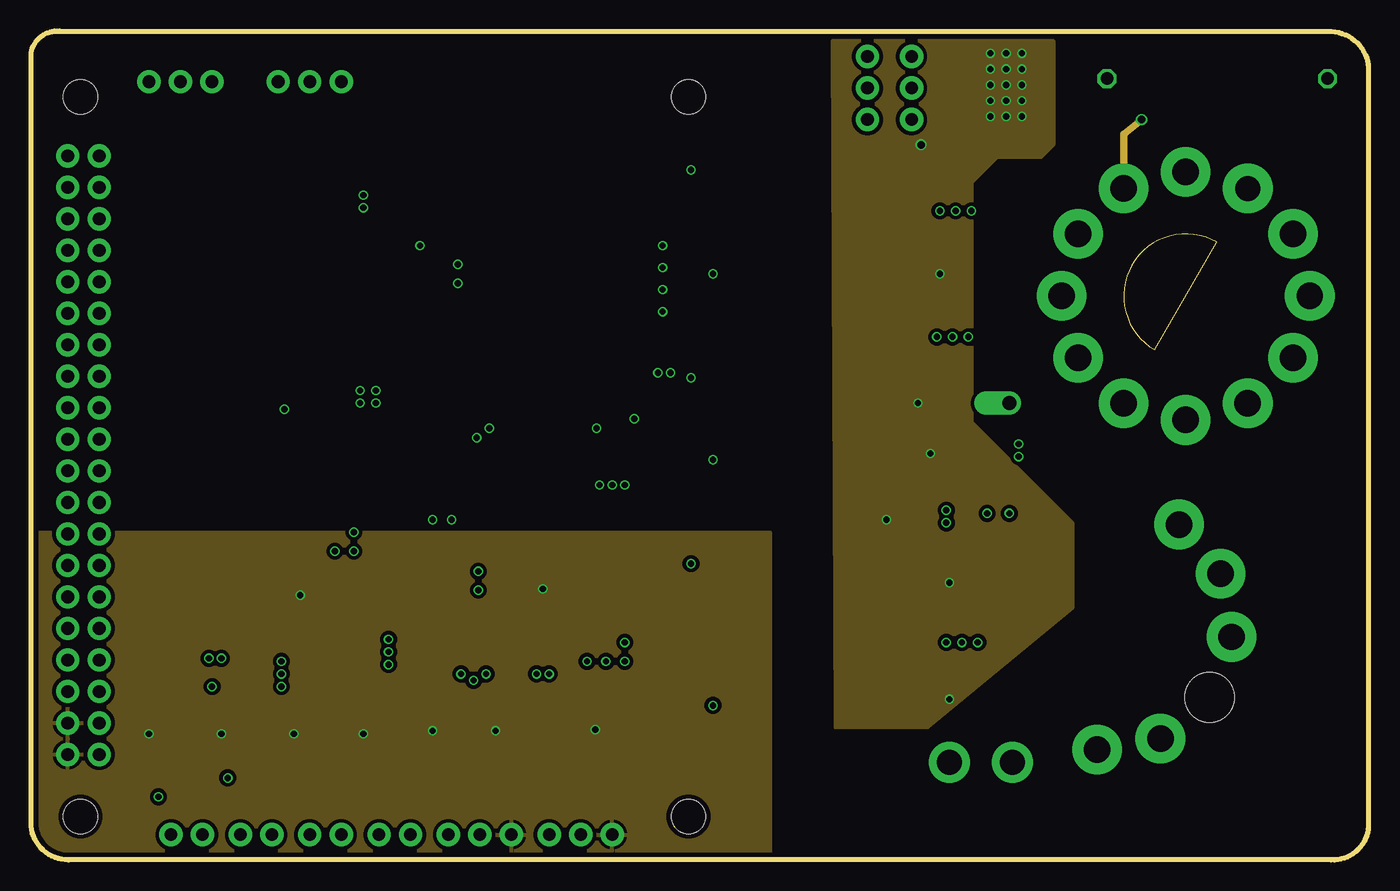
[diagram p3: board, inner layer Route2]
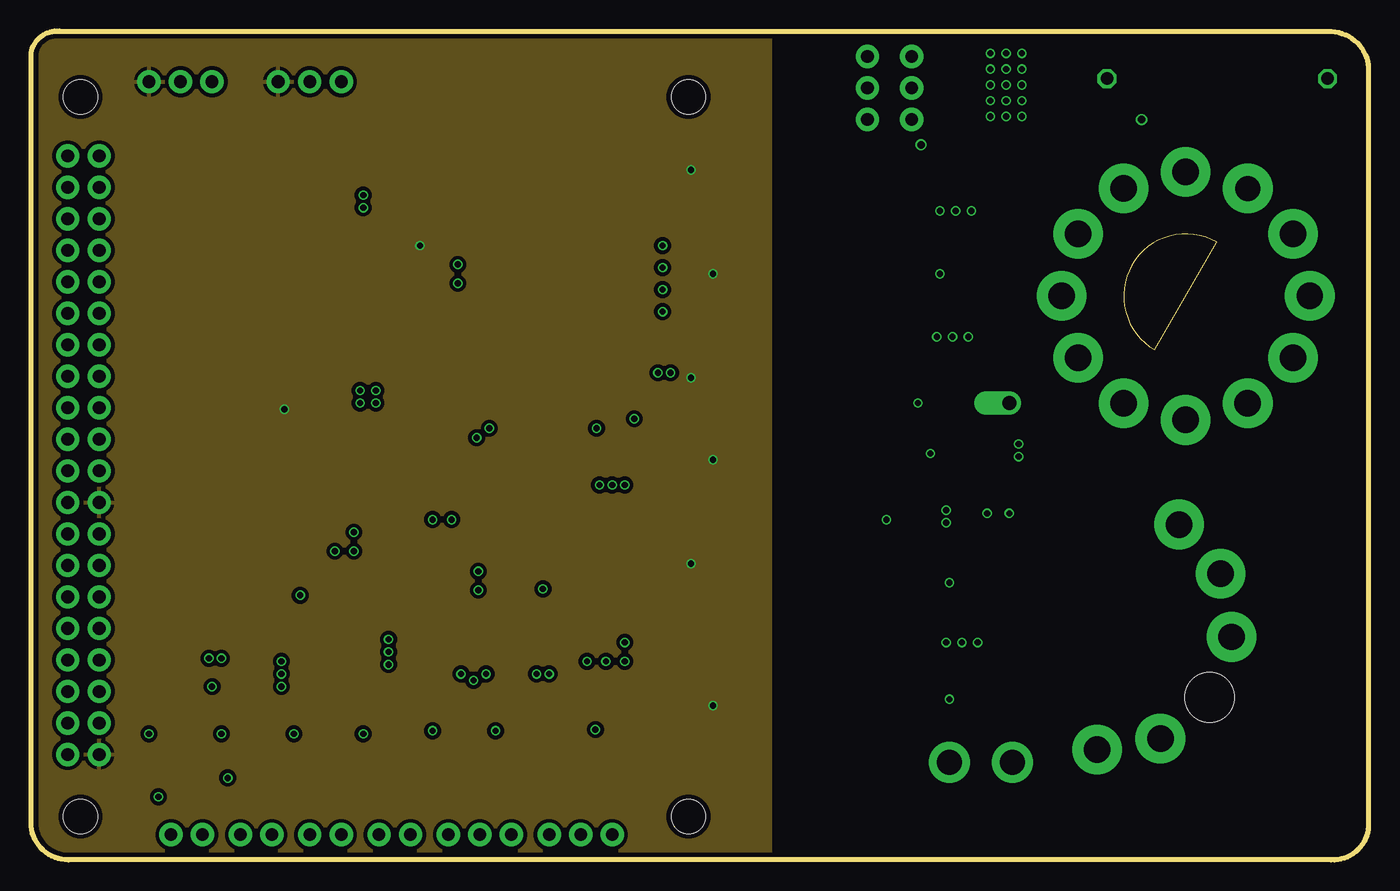
[diagram p4: board, inner layer Route15]
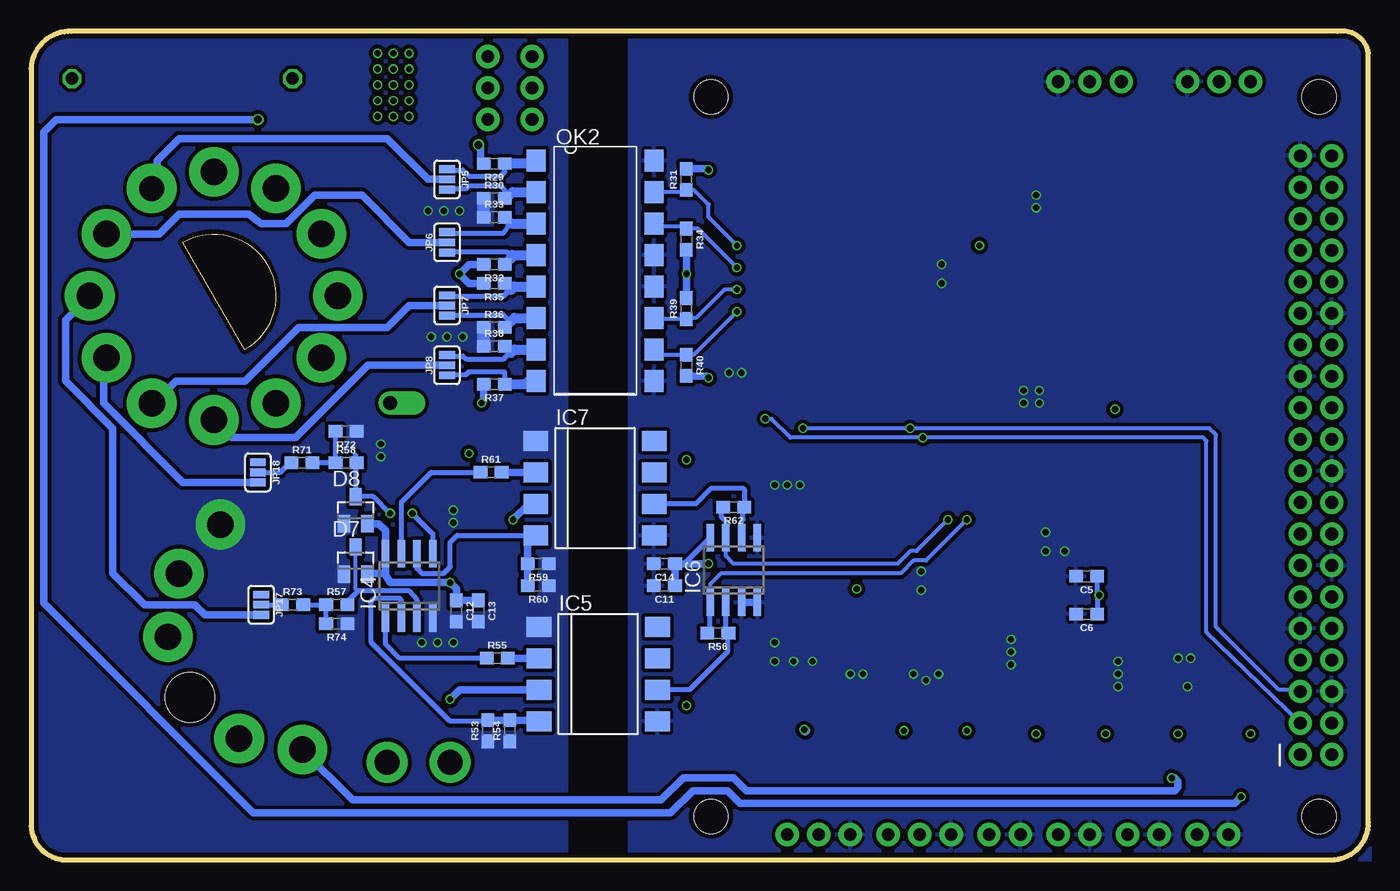
[diagram p5: board, bottom side, seen from below]

Size 107.81 x 66.83 mm. Coordinates in mm from the lower left corner, seen from the top.
Outline: 107.81,63.79 107.81,2.75 arc-90 104.81,0 3,0 arc-90 0,3 0,65.06 arc-90 2.49,66.79 104.55,66.79 arc-90 107.81,63.79
Copper layers (1*2*15*16): Top 0.035559375mm / dielectric 0.17018125mm / Route2 0.01778125mm / dielectric 47mil / Route15 0.01778125mm / dielectric 0.17018125mm / Bottom 0.035559375mm
Design rules "oshpark-4layer": minimum track width 5mil, minimum drill 10mil, track to track 5mil, track to pad 5mil, pad to pad 5mil, via to via 5mil, smd to smd 5mil, copper to edge 15mil, drill to drill 6mil, minimum pad ring 4mil, minimum via ring 4mil, stop-mask expansion 1.5mil, vias tented up to drill 0mil, thermal gap 10mil
Holes 2.75 mm at 53,3.5 53,61.5 4,3.5 4,61.5

### Footprints (pad centres in the part's own frame; a part is rotated, then mirrored left to right if it is on the bottom)
BATTCON_12MM = smd 8 x 8: GND 0,0 | smd 3.175 x 3.175: PWR@1 -7.874,0; PWR@2 7.874,0
0603 = smd 1.1 x 1: 1 -0.85,0; 2 0.85,0
SOT23 = smd 1 x 1.4: 1 -0.95,-1.1; 2 0.95,-1.1; 3 0,1.1
TSSOP14 = smd 1.26 x 0.36: 1 -2.918,1.95; 2 -2.918,1.3; 3 -2.918,0.65; 4 -2.918,0; 5 -2.918,-0.65; 6 -2.918,-1.3; 7 -2.918,-1.95; 8 2.918,-1.95; 9 2.918,-1.3; 10 2.918,-0.65; 11 2.918,0; 12 2.918,0.65; 13 2.918,1.3; 14 2.918,1.95
SO16 = smd 1.5 x 0.6: 1 -2.7,4.445; 2 -2.7,3.175; 3 -2.7,1.905; 4 -2.7,0.635; 5 -2.7,-0.635; 6 -2.7,-1.905; 7 -2.7,-3.175; 8 -2.7,-4.445; 9 2.7,-4.445; 10 2.7,-3.175; 11 2.7,-1.905; 12 2.7,-0.635; 13 2.7,0.635; 14 2.7,1.905; 15 2.7,3.175; 16 2.7,4.445
SSOP28 = smd 0.4 x 1.5: 1 -4.225,-3.625; 2 -3.575,-3.625; 3 -2.925,-3.625; 4 -2.275,-3.625; 5 -1.625,-3.625; 6 -0.975,-3.625; 7 -0.325,-3.625; 8 0.325,-3.625; 9 0.975,-3.625; 10 1.625,-3.625; 11 2.275,-3.625; 12 2.925,-3.625; 13 3.575,-3.625; 14 4.225,-3.625; 15 4.225,3.625; 16 3.575,3.625; 17 2.925,3.625; 18 2.275,3.625; 19 1.625,3.625; 20 0.975,3.625; 21 0.325,3.625; 22 -0.325,3.625; 23 -0.975,3.625; 24 -1.625,3.625; 25 -2.275,3.625; 26 -2.925,3.625; 27 -3.575,3.625; 28 -4.225,3.625
SO08 = smd 2.2 x 0.6: 1 -2.6,1.905; 2 -2.6,0.635; 3 -2.6,-0.635; 4 -2.6,-1.905; 5 2.6,-1.905; 6 2.6,-0.635; 7 2.6,0.635; 8 2.6,1.905
DIL8-SMD = smd 2 x 1.6: 1 -4.77,3.81; 2 -4.77,1.27; 3 -4.77,-1.27; 4 -4.77,-3.81; 5 4.77,-3.81; 6 4.77,-1.27; 7 4.77,1.27; 8 4.77,3.81
UMAX10 = smd 0.9 x 0.32: 1 -2.25,1; 2 -2.25,0.5; 3 -2.25,0; 4 -2.25,-0.5; 5 -2.25,-1; 6 2.25,-1; 7 2.25,-0.5; 8 2.25,0; 9 2.25,0.5; 10 2.25,1
2X20 = drill 1.016 pad 1.88: 1 0,0; 2 0,2.54; 3 2.54,0; 4 2.54,2.54; 5 5.08,0; 6 5.08,2.54; 7 7.62,0; 8 7.62,2.54; 9 10.16,0; 10 10.16,2.54; 11 12.7,0; 12 12.7,2.54; 13 15.24,0; 14 15.24,2.54; 15 17.78,0; 16 17.78,2.54; 17 20.32,0; 18 20.32,2.54; 19 22.86,0; 20 22.86,2.54; 21 25.4,0; 22 25.4,2.54; 23 27.94,0; 24 27.94,2.54; 25 30.48,0; 26 30.48,2.54; 27 33.02,0; 28 33.02,2.54; 29 35.56,0; 30 35.56,2.54; 31 38.1,0; 32 38.1,2.54; 33 40.64,0; 34 40.64,2.54; 35 43.18,0; 36 43.18,2.54; 37 45.72,0; 38 45.72,2.54; 39 48.26,0; 40 48.26,2.54
1X02 = drill 1.016 pad 1.88: 1 0,0; 2 2.54,0
VOLVO_CON_31 = drill 2.134 pad 4: 1 -10,0; 2 -8.66,-5; 3 -5,-8.66; 4 0,-10; 5 5,-8.66; 6 8.66,-5; 7 10,0; 8 8.66,5; 9 5,8.66; 10 0,10; 11 -5,8.66 | drill 2 pad 4: 12 -8.66,5
VOLVO_CON_32 = drill 2.134 pad 4: 1 8.66,5; 2 5,8.66; 3 -8.66,5; 4 -10,0; A -5,8.66 | hole 4: 0,10
1X03 = drill 1.016 pad 1.88: 1 0,0; 2 2.54,0; 3 5.08,0
1X01_OFFSET = drill 1.118 pad 1.88 offset: 1 0,0
1X01_2MM = drill 2 pad 3.302: 1 0,0
SMT-JUMPER_3_NO_SILK = smd 0.635 x 1.27: 1 -0.813,0; 2 0,0; 3 0.813,0
SMD16 = smd 1.524 x 1.778: 1 -4.763,8.89; 2 -4.763,6.35; 3 -4.763,3.81; 4 -4.763,1.27; 5 -4.763,-1.27; 6 -4.763,-3.81; 7 -4.763,-6.35; 8 -4.763,-8.89; 9 4.763,-8.89; 10 4.763,-6.35; 11 4.763,-3.81; 12 4.763,-1.27; 13 4.763,1.27; 14 4.763,3.81; 15 4.763,6.35; 16 4.763,8.89
0617/17 = drill 1.016 octagon: 1 -8.89,0; 2 8.89,0
TACTILE_SWITCH_SMD_6.0X3.5MM = smd 2.3 x 1.6: 1 -3.15,0; 2 3.15,0
ECX-34RR = smd 1.1 x 1.9: 1 -1.25,0; 2 1.25,0

### Placement (x,y rotation side)
BT1  41.77,54.86 0 top
C1  15.35,24.13 270 top
C2  15.35,18.54 90 top
C3  23.23,16.76 270 top
C4  30.59,24.13 270 top
C5  22.72,22.86 180 bottom
C6  22.72,19.81 180 bottom
C7  23.23,35.56 270 top
C8  21.7,35.56 270 top
C9  51.42,36.07 270 top
C10  53.2,36.07 270 top
C11  56.75,22.1 180 bottom
C12  73.52,20.07 270 bottom
C13  71.74,20.07 270 bottom
C14  56.75,23.88 180 bottom
C15  38.47,21.84 180 top
C16  38.47,23.37 180 top
C17  32.62,15.49 0 top
C18  46.34,18.29 270 top
C19  32.12,48.01 0 top
C20  32.12,46.48 0 top
D1  11.8,12.95 270 top
D2  17.38,12.95 270 top
D3  22.97,12.95 270 top
D4  28.56,12.95 270 top
D5  34.15,12.95 270 top
D6  40.5,12.95 270 top
D7  81.65,24.13 0 bottom
D8  81.65,28.19 0 bottom
IC1  22.97,21.34 0 top
IC2  29.32,32.26 90 top
IC3  45.32,35.56 0 top
IC4  77.33,22.1 90 bottom
IC5  62.09,14.99 0 bottom
IC6  51.17,23.37 90 bottom
IC7  62.34,29.97 0 bottom
IC8  38.47,18.03 0 top
IC9  28.81,50.8 270 top
J1  5.5,8.5 90 top
J2  11.29,2.03 0 top
J3  16.88,2.03 0 top
J4  22.46,2.03 0 top
J5  28.05,2.03 0 top
J6  93.08,45.47 270 top
J7  86.81,18.85 235 top
J8  41.77,2.03 0 top
J9  67.42,59.69 90 top
J10  33.64,2.03 0 top
J11  70.98,59.69 90 top
J12  78.85,36.83 90 top
J13  74.03,7.87 0 top
J14  79.11,7.87 0 top
J15  14.59,62.74 180 top
J16  25,62.74 180 top
JP1  74.28,39.88 90 top
JP2  74.28,44.7 270 top
JP3  74.28,49.78 90 top
JP4  74.28,54.86 270 top
JP5  74.28,54.86 270 bottom
JP6  74.28,49.78 90 bottom
JP7  74.28,44.7 270 bottom
JP8  74.28,39.88 90 bottom
JP9  75.3,14.99 90 top
JP10  75.3,19.81 270 top
JP11  75.3,24.89 90 top
JP12  75.3,29.72 270 top
JP13  13.07,6.35 180 top
JP14  18.65,6.6 180 top
JP15  24.24,6.6 180 top
JP16  29.83,6.6 180 top
JP17  89.27,20.57 270 bottom
JP18  89.52,31.24 270 bottom
JP19  35.42,6.6 180 top
JP20  43.55,6.6 180 top
JP21  74.03,62.23 270 top
JP22  10.02,38.86 270 top
JP23  9.26,52.83 90 top
JP24  9.26,47.75 90 top
OK1  62.34,47.5 180 top
OK2  62.34,47.5 0 bottom
OK3  62.6,22.35 180 top
R1  13.09,9.38 90 top
R2  18.4,24.13 270 top
R3  18.4,18.54 90 top
R4  18.65,9.4 90 top
R5  26.27,16.76 270 top
R6  24.24,9.4 90 top
R7  27.54,24.13 270 top
R8  29.83,9.4 90 top
R9  11.56,9.42 90 top
R10  17.13,9.4 90 top
R11  22.72,9.4 90 top
R12  28.31,9.4 90 top
R13  16.88,24.13 90 top
R14  24.75,16.76 90 top
R15  16.88,18.54 270 top
R16  29.07,24.13 90 top
R17  70.72,38.35 0 top
R18  70.72,41.4 180 top  (not fitted)
R19  54.98,39.88 270 top
R20  70.72,46.48 0 top  (not fitted)
R21  70.72,42.93 180 top
R22  54.98,44.45 90 top
R23  70.72,48.01 0 top  (not fitted)
R24  70.72,51.56 180 top
R25  70.72,56.13 0 top
R26  70.72,53.09 180 top  (not fitted)
R27  54.98,50.04 270 top
R28  54.98,54.86 90 top
R29  70.47,56.13 180 bottom
R30  70.47,53.34 0 bottom  (not fitted)
R31  54.98,54.86 90 bottom
R32  70.47,48.01 180 bottom
R33  70.47,51.82 0 bottom  (not fitted)
R34  54.98,50.04 270 bottom
R35  70.47,46.48 180 bottom  (not fitted)
R36  70.47,42.93 0 bottom
R37  70.47,38.35 180 bottom  (not fitted)
R38  70.47,41.4 0 bottom
R39  54.98,44.45 90 bottom
R40  54.98,39.88 270 bottom
R41  71.49,13.46 0 top
R42  71.49,16.51 180 top
R43  54.98,14.99 270 top
R44  71.49,21.59 0 top
R45  71.49,18.03 180 top  (not fitted)
R46  54.98,19.56 90 top
R47  71.49,23.11 0 top
R48  71.49,26.67 180 top  (not fitted)
R49  71.49,31.24 0 top
R50  71.49,28.19 180 top
R51  54.98,25.15 270 top
R52  54.98,29.72 90 top
R53  70.98,10.41 90 bottom
R54  69.2,10.41 90 bottom
R55  70.22,16.26 0 bottom
R56  52.44,18.29 180 bottom
R57  83.17,20.57 0 bottom
R58  82.41,32 0 bottom
R59  66.91,23.88 180 bottom
R60  66.91,22.1 180 bottom
R61  70.72,31.24 0 bottom
R62  51.17,28.45 180 bottom
R63  33.89,9.65 90 top  (not fitted)
R64  32.62,18.54 0 top
R65  35.42,9.65 90 top
R66  32.62,17.02 180 top
R67  43.55,9.65 90 top
R68  43.29,18.29 270 top
R69  41.77,9.65 90 top
R70  44.82,18.29 90 top
R71  85.96,32 0 bottom
R72  82.41,34.54 180 bottom
R73  86.73,20.57 0 bottom
R74  83.17,19.05 180 bottom
R75  32.12,44.7 180 top
R76  19.92,59.69 180 top
R77  25,59.69 180 top  (not fitted)
R78  9.51,59.69 180 top
R79  14.59,59.69 180 top  (not fitted)
R82  95.62,62.99 180 top
S1  24.24,50.55 270 top  (not fitted)
Y1  29.58,55.63 0 top

### Tracks (layer width: path | path; a pad name or v marks a point on that pad's centre or on a via)
3.3V  (via drill 0.5)
  Top 0.305: IC2.15 IC2.16 | C10.1 C9.1 arc-90 51.25,37.08 47.86,37.08 47.6,37.35 | 47.6,37.35 IC3.18 | IC3.9 46.3,33.31 46.09,33.53 44.92,33.53 44.56,33.89 44.56,35.25 46.39,37.08 47.33,37.08 47.6,37.35 | IC9.10 30.36,48.01 C19.1
  Top 0.406: IC2.16 24.92,35 C7.1 C8.1 21.61,36.32 v20.43,36.32 | R78.2 8.75,59.78 8.75,60.71 9.51,61.47 J15.3 | R76.2 19.16,59.78 19.16,60.71 19.92,61.47 J16.3
  Top 0.61: R52.2 v54.98,32.26 | R51.2 54.56,23.88 v53.2,23.88 53.2,21.84 54.47,20.57 54.98,20.57 R46.2 | R43.2 v54.98,12.45 | C10.1 v53.2,38.86 53.45,39.12 54.89,39.12 R40.2 | R39.2 v54.98,47.24 R34.2 | R31.2 53.29,55.71 v53.2,55.63 | R75.2 C20.1 C19.1 31.35,48.09 v31.35,49.53
  Bottom 0.406: IC6.8 55.16,23.88 55.74,23.88
  Bottom 0.61: C11.1 C14.1 55.74,23.88 v53.2,23.88 | R40.2 53.36,39.03 v53.2,38.86 | R39.2 v54.98,47.24 R34.2 | R31.2 53.29,55.71 v53.2,55.63
  pour Route15 (isolate 0.305): 0.11,66.8 59.55,67.06 59.55,0.25 0.11,0
5V  (via drill 0.5)
  Top 0.305: R9.2 10.7,11.13 D1.2 | R10.2 16.28,11.09 D2.2 | D3.2 21.96,11.92 21.96,11.01 R11.2 | R12.2 28.22,10.25 27.54,10.92 27.54,11.92 D4.2 | R63.2 33.55,10.5 | 33.13,11.92 D5.2
  Top 0.406: 33.55,10.5 33.13,10.92 33.13,11.92 | IC1.4 v21.7,21.34
  Top 0.61: IC8.8 39.32,21.69 C15.1 C16.1
  Top 0.813: v9.51,10.16 11.45,10.16 R9.2 | R10.2 17.04,10.16 v15.35,10.16 | R11.2 22.63,10.16 v21.19,10.16 | R12.2 28.22,10.16 v26.78,10.16 | R63.2 33.81,10.41 v32.37,10.41 | v41.26,21.84 C15.1 | v37.45,10.41 39.04,12 D6.2 | v45.49,10.5 R67.2
  Bottom 0.406: C6.1 21.87,21.17 v21.7,21.34 21.87,21.5 C5.1
  Bottom 0.813: v45.49,10.5 45.4,10.41
  pour Route2 (isolate 0.305): -0.14,26.42 59.55,26.42 59.55,0 -0.14,0
12V  (via drill 0.5, 0.6)
  Top 0.61: JP21.2 v78.6,62.48 | R25.2 71.57,57.49 v71.74,57.66 | R23.2 72.5,48.01 v73.26,47.24 72.5,46.48 R20.2 | R17.2 71.57,36.92 v71.49,36.83 | R49.2 72.34,32.6 v72.5,32.77 | v74.03,22.35 74.03,21.95 73.67,21.59 R44.2 R47.2 | R41.2 73.52,13.46 v74.03,12.95
  Bottom 0.61: C13.1 C12.1 73.52,21.84 v74.03,22.35 78.85,22.35 79.23,22.99 79.23,23.11 | 79.23,23.11 IC4.8 79.23,26.54 79.78,27.09 D8.2 | R37.2 71.32,37 v71.49,36.83 | R35.2 72.5,46.48 v73.26,47.24 72.5,48.01 R32.2 | IC7.3 67.68,28.7 v68.95,27.43 | IC5.3 73.26,13.72 v74.03,12.95 | R29.2 R25.2 71.57,57.49 v71.74,57.66 | D7.2 80.61,23.11 79.23,23.11
  other vias: 78.6,65.02 78.6,61.21 78.6,63.75 78.6,59.94 77.33,65.02 77.33,62.48 77.33,61.21 77.33,59.94 77.33,63.75 79.87,65.02 79.87,63.75 79.87,62.48 79.87,61.21 79.87,59.94
  pour Top (isolate 0.305, no thermals): 73.52,66.29 73.52,58.67 88,58.93 88,59.38 87.94,66.29
  pour Route2 (isolate 0.305): 82.41,66.04 82.41,57.66 81.39,56.64 77.84,56.64 75.8,54.61 75.8,35.31 83.93,27.18 83.93,20.32 72.25,10.67 64.88,10.67 64.63,66.04
12V-FUSE_8
  Bottom 0.61: J6.9 101.97,40.24 101.97,36.83 95.56,30.43 JP18.3
!SPI_CS
  Top 0.305: JP22.2 31.1,38.86 32.5,37.47 IC2.10
AC_RELAY/VSS_TO_ECU
  Top 0.61: J6.6 86.58,36.83 J12.1
ADC1_IN
  Top 0.305: C1.1 R13.2 R2.1 18.49,24.89 20.69,24.89 24.88,29.08 IC2.1
ADC2_IN
  Top 0.305: C2.1 R15.2 R3.1 21.36,17.69 22.46,18.8 22.46,25.4 25.26,28.19 25.77,28.19 26.15,28.57 IC2.2
ADC3_IN
  Top 0.305: R5.1 R14.2 C3.1 23.48,18.29 22.97,18.8 22.97,24.89 25.51,27.43 27.04,27.43 27.42,27.81 IC2.3
ADC4_IN
  Top 0.305: C4.1 R16.2 R7.1 27.8,25.65 28.69,26.54 IC2.4
ADC5_IN
  Top 0.305: C17.1 R66.2 R64.1 31.86,18.63 31.86,25.65 29.96,27.56 IC2.5
ADC6_IN
  Top 0.305: C18.1 R70.2 R68.1 43.29,22.1 40.5,24.89 33.39,24.89 31.23,27.05 IC2.6
BLINKER_LEFT_P
  Bottom 0.61: JP7.2 77.33,44.7 79.11,42.93 86.22,42.93 90.54,38.61 96.12,38.61 97.93,36.81 J6.8
BLINKER_RIGHT_P
  Bottom 0.61: J6.7 91.65,34.04 86.47,34.04 80.63,39.88 JP8.2
BRAKE_FAILURE_N
  Top 0.61: J6.1 91.39,57.15 77.84,57.15 75.55,54.86 JP4.2
BULB_FAILURE_N
  Bottom 0.61: J6.12 97.65,54.55 97.65,56.39 95.87,58.17 79.11,58.17 75.8,54.86 JP5.2
CHARGING_N
  Top 1.27: J6.11 104.51,53.24 104.51,53.76 R82.1
  Bottom 0.61: JP6.2 77.33,49.78 81.14,53.59 84.95,53.59 87.23,51.31 89.27,51.31 90.28,52.07 95.87,52.07 97.47,50.47 J6.11
  pour Top (isolate 0.305, no thermals): 107.81,53.85 107.81,63.29 107.09,64.01 102.68,64.01 101.97,63.29 101.97,53.85 99.43,51.31 99.43,49.53 100.7,48.26 102.22,48.26
CHECK_ENGINE_N
  Top 0.61: J14.1 80.63,9.4 80.63,19.05 79.87,19.81 JP10.2
CONN_32_PIN3
  Top 0.61: JP12.2 81.39,29.72 88.03,23.08 J7.3
COOLANT_TEMP_SENSOR  (via drill 0.5, 0.6)
  Top 0.61: v10.27,5.08 10.27,5.84 10.78,6.35 JP13.3
  Route2 0.61: J6.2 88.08,58.5 v89.52,59.69
  Bottom 0.61: v89.52,59.69 105.78,59.69 106.79,58.67 106.79,20.72 89.88,3.81 56.25,3.81 54.47,5.59 51.67,5.59 50.66,4.57 10.78,4.57 v10.27,5.08
DIMMER_VOUT
  Bottom 0.61: JP17.3 93.79,19.76 94.6,20.57 98.66,20.57 101.2,23.11 101.2,34.8 105.01,38.61 105.01,43.53 J6.10
FUEL_LVL_SENDER  (via drill 0.5)
  Top 0.61: v15.86,6.6 JP14.3
  Bottom 0.61: J7.1 85.94,8.86 81.9,4.83 57.01,4.83 55.23,6.6 51.17,6.6 50.15,5.59 15.61,5.59 15.35,5.84 15.35,6.35 15.61,6.6 v15.86,6.6
GND  (via drill 0.5)
  Top 0.305: IC3.10 46.95,33.27 46.85,33.27 arc-90 46.95,33.17 46.95,30.84 46.85,30.73 v46.85,30.23
  Bottom 0.61: IC6.3 IC6.4
  other vias: 28.81,15.75 28.81,17.78 24.5,24.89 26.02,24.89 26.02,26.42 35.67,14.48 36.05,21.74 36.05,23.27 20.18,13.97 14.59,13.97 50.53,39.27 51.55,39.27 26.53,37.85 26.53,36.83 27.8,36.83 27.8,37.85 45.83,30.23 47.86,30.23 20.18,14.99 20.18,16 14.34,16.26 15.35,16.26 36.69,14.99 34.66,14.99 41.77,14.99 40.75,14.99 44.82,16 46.34,16 47.86,17.53 47.86,16 28.81,16.76 34.4,48.01 34.4,46.48 26.78,52.58 26.78,53.59
  pour Top (isolate 0.305): 0.62,0.25 0.37,66.55 59.55,66.8 59.55,0.25
  pour Bottom (isolate 0.305): -0.14,0 0.37,66.55 59.55,66.55 59.55,0.25
GND-ISO  (via drill 0.5)
  Top 0.61: R21.1 R18.1 | R26.1 R24.1
  Bottom 1.016: R38.1 R36.1 | R33.1 R30.1
  other vias: 73.77,17.53 75.04,17.53 76.31,17.53 73.01,42.16 74.28,42.16 75.55,42.16 73.26,52.32 74.53,52.32 75.8,52.32 79.61,32.51 79.61,33.53 73.77,28.19 73.77,27.18
  pour Top (isolate 0.305, rank 2, no thermals): 64.63,66.8 106.25,66.8 108.05,64.99 107.56,1.43 106.13,0 64.63,0
  pour Bottom (isolate 0.305, no thermals): 108.05,64.81 107.81,1.79 106.02,0 64.63,0 64.63,66.8 106.07,66.8
GPIO6
  Top 0.406: JP24.1 8.92,46.6 J1.31
GPIO13
  Top 0.406: JP24.3 8.68,49.14 J1.33
GPIO17
  Top 0.406: J1.11 5.84,21.54
GPIO19
  Top 0.406: JP23.1 8.92,51.68 J1.35
GPIO26
  Top 0.406: JP23.3 8.68,54.22 J1.37
GPIO27
  Top 0.406: J1.13 6.07,23.16
HIGH_BEAM_P
  Top 0.61: J6.3 83.73,49.78 JP3.2
IN1_12V_SIGNAL
  Bottom 0.406: R73.2 R57.1 R74.2
IN1N
  Top 0.406: JP1.3 74.23,40.64 73.01,40.64 72.76,40.39 70.47,40.39 69.87,40.98 R18.2
  Top 1.016: R18.2 69.49,40.99 66.91,40.99 OK1.2
IN1P
  Top 0.406: JP1.1 74.23,39.12 72.76,39.12 72.5,39.37 70.22,39.37 69.87,39.03 R17.1
  Top 1.016: R17.1 67.42,38.35 67.17,38.44 OK1.1
IN2N
  Top 0.406: JP2.3 74.23,43.94 70.22,43.94 69.87,43.6 R21.2
  Top 1.016: R21.2 69.39,43.49 67.42,43.49 OK1.3
IN2P
  Top 0.406: JP2.1 74.23,45.47 70.47,45.47 69.87,46.06 R20.1
  Top 1.016: R20.1 69.45,45.97 67.17,46.04 OK1.4
IN3N
  Top 0.406: JP3.3 74.23,50.55 70.47,50.55 69.87,51.14 R24.2
  Top 1.016: R24.2 69.39,51.09 67.17,51.09 OK1.6
IN3P
  Top 0.406: JP3.1 74.23,49.02 70.22,49.02 69.87,48.68 R23.1
  Top 1.016: R23.1 69.2,48.51 67.42,48.54 OK1.5
IN4N
  Top 0.406: JP4.3 74.23,54.1 70.22,54.1 69.87,53.76 R26.2
  Top 1.016: R26.2 69.39,53.69 67.17,53.69 OK1.7
IN4P
  Top 0.406: JP4.1 74.23,55.63 73.01,55.63 72.5,55.12 70.47,55.12 69.87,55.71 R25.1
  Top 1.016: R25.1 67.17,56.13 67.1,56.2 OK1.8 67.17,56.44
IN5N
  Bottom 0.406: 69.73,53.36 R30.2 69.62,54.01 69.96,54.36 72.5,54.36 72.76,54.1 74.23,54.1 JP5.3
  Bottom 0.61: R30.2 69.52,53.44 69.38,53.44
  Bottom 0.813: 69.38,53.44 68.97,53.85 OK2.2
IN5P
  Bottom 0.406: JP5.1 74.23,55.63 73.01,55.63 72.5,55.12 69.96,55.12 69.62,55.46 R29.1
  Bottom 0.61: R29.1 69.59,56.11 69.59,55.98
  Bottom 0.813: 69.59,55.98 69.44,56.13 | OK2.1 67.36,56.13 R29.1
IN6N
  Bottom 0.406: JP6.3 74.23,50.55 69.71,50.55 69.16,51.35
  Bottom 0.813: R33.2 69.16,51.35 69.11,51.31 OK2.3
IN6P
  Bottom 0.406: JP6.1 73.98,49.02 69.45,49.02 69.11,48.68 69.11,48.51
  Bottom 0.813: R32.1 69.11,48.51 | 69.11,48.68 69.02,48.77 OK2.4
IN7N
  Bottom 0.406: JP7.3 74.23,43.94 69.71,43.94 69.2,43.43 69.11,43.43
  Bottom 0.813: R36.2 69.11,43.43 68.86,43.69 OK2.6
IN7P
  Bottom 0.406: 69.11,45.97 69.45,45.97 69.45,45.72 69.71,45.47 74.23,45.47 JP7.1
  Bottom 0.813: R35.1 69.11,45.97 68.86,46.23 OK2.5
IN8N
  Bottom 0.406: JP8.3 74.23,40.64 73.01,40.64 72.76,40.39 69.71,40.39 69.2,40.89 69.11,40.89
  Bottom 0.813: R38.2 69.11,40.89 68.86,41.15 OK2.7
IN8P
  Bottom 0.406: JP8.1 74.23,39.12 72.76,39.12 72.5,39.37 69.71,39.37 69.62,39.28 R37.1
  Bottom 0.813: R37.1 67.93,38.35 67.68,38.61 OK2.8
IN9N
  Top 0.406: JP9.3 75.25,15.75 73.52,15.75 73.26,15.49 70.98,15.49 70.64,15.84 R42.2
  Top 1.016: R42.2 70.13,16 OK3.2
IN9P
  Top 0.406: JP9.1 75.25,14.22 73.77,14.22 73.52,14.48 70.98,14.48 70.64,14.14 R41.1
  Top 1.016: OK3.1 R41.1
IN10N
  Top 0.406: JP10.3 75.25,19.05 71.23,19.05 70.64,18.45 R45.2
  Top 1.016: R45.2 70.13,18.54 OK3.3
IN10P
  Top 0.406: JP10.1 75.25,20.57 70.98,20.57 70.47,21.08 70.13,21.08
  Top 1.016: R44.1 70.13,21.08 OK3.4
IN11N
  Top 0.406: JP11.3 75.25,25.65 70.98,25.65 70.64,26 R48.2
  Top 1.016: R48.2 70.13,26.16 OK3.6
IN11P
  Top 0.406: JP11.1 75.25,24.13 70.98,24.13 70.64,23.79 R47.1
  Top 1.016: R47.1 70.13,23.62 OK3.5
IN12N
  Top 0.406: JP12.3 75.25,28.96 73.52,28.96 73.26,29.21 71.23,29.21 70.64,28.61 R50.2
  Top 1.016: R50.2 70.13,28.7 OK3.7
IN12P
  Top 0.406: JP12.1 75.25,30.48 73.52,30.48 73.26,30.23 70.72,30.23 70.64,30.31 R49.1
  Top 1.016: OK3.8 R49.1
N$1
  Top 0.305: IC1.2 IC1.1 R2.2
N$2
  Bottom 0.305: 81.44,21.67 81.65,21.87 D7.3
  Bottom 0.406: IC4.3 76.69,20.95 77.33,21.67 81.44,21.67 82.32,20.79 R57.2 82.66,20.92
N$3
  Top 0.305: R1.2 13.07,10.26 13.07,12.45 12.9,12.62 D1.3 12.81,13.04 12.81,21.52 13.28,21.99 IC1.3
N$4
  Bottom 0.406: IC4.2 77.96,20.95 78.09,21.08 80.12,21.08 80.38,20.83 80.38,17.53 74.03,11.18 71.07,11.18 R53.2
  Bottom 0.61: IC5.4 66.95,11.26 R54.2 R53.2
N$5
  Top 0.305: R3.2 IC1.7 IC1.6
N$6  (via drill 0.5)
  Top 0.406: v78.85,27.94 v77.07,27.94
  Bottom 0.406: v77.07,27.94 75.42,26.29 IC4.5 | R58.2 81.65,32.68 D8.3 80.21,29.29 v78.85,27.94
N$7
  Top 0.305: R4.2 18.65,12.45 18.48,12.62 D2.3 18.65,13.12 18.65,14.99 18.4,15.24 13.89,15.24 13.32,15.81 13.32,20.06 13.95,20.69 IC1.5
N$8
  Bottom 0.406: IC7.4 73.46,26.16 74.03,25.59 74.03,23.62 74.53,23.11 76.31,23.11 76.69,23.5 IC4.6
  Bottom 0.61: IC7.4 67.76,25.51 R59.2 R60.2
N$9
  Top 0.305: IC1.8 IC1.9 26.56,20.04 27.29,19.3 27.29,16.51 26.78,16 26.11,16 R5.2
N$10
  Top 0.61: JP21.3 72.3,59.69 J11.1
  Top 1.016: J9.1 J11.1
N$11
  Top 0.305: R6.2 24.24,12.78 D3.3 | D3.3 23.99,12.95 | D3.3 25.6,14.73 27.23,14.73 27.8,15.3 27.8,20.07 27.18,20.69 IC1.10
N$12
  Top 1.016: J9.2 J11.2
N$13
  Top 0.305: IC1.13 IC1.14 27.79,23.29 R7.2
N$14
  Top 0.61: JP21.1 72.3,64.77 J11.3
  Top 1.016: J9.3 J11.3
N$15
  Top 0.305: R8.2 29.83,12.78 D4.3 29.83,13.12 29.83,19.81 27.66,21.99 IC1.12
N$16
  Top 0.305: 13.07,8.53 R1.1 13.05,8.57
  Top 0.406: JP13.2 13.07,8.53 | R9.1 13.05,8.57
N$17
  Bottom 0.406: R72.2 R58.1 R71.2
N$18
  Bottom 0.406: R56.1 51.8,18.25 | 51.8,18.25 IC6.2 | 51.8,18.25 51.67,18.12 51.67,16.76 54.72,13.72 IC5.6
N$19
  Bottom 0.406: JP18.2 87.74,31.24 86.81,32.17 R71.1
N$20
  Bottom 0.406: R55.1 78.09,16.26 79.23,17.4 IC4.1
N$21
  Bottom 0.406: IC4.7 77.96,28.83 75.55,31.24 R61.1
N$22
  Top 0.305: R4.1 R10.1
  Top 0.406: JP14.2 R4.1
N$23
  Bottom 0.406: JP17.2 R73.1
N$24
  Top 0.305: IC9.1 29.83,53.07 29.83,54.1 30.83,55.1 Y1.2
N$25
  Bottom 0.61: IC5.2 R55.2
N$26
  Bottom 0.61: IC7.2 R61.2
N$27
  Bottom 0.406: IC6.6 50.53,27.3 50.4,27.43 50.4,28.36 R62.1 50.32,29.88 50.4,29.97 52.94,29.97 54.21,28.7 IC7.6
N$28
  Top 0.305: IC8.1 IC8.2 35.83,18.71 33.73,18.71 R64.2
N$29
  Top 0.305: 35.42,12.78 D5.3 36.43,12.95 37.7,13.97 37.7,17.02 37.32,17.4 IC8.3 35.99,17.53
  Top 0.406: R65.2 35.42,12.78
N$30
  Top 0.305: R6.1 R11.1
  Top 0.406: JP15.2 R6.1
N$31
  Top 0.305: R8.1 R12.1
  Top 0.406: JP16.2 R8.1
N$32
  Top 0.305: IC9.2 29.32,54.1 28.33,55.1 Y1.1
N$33
  Top 0.406: JP23.2 11.29,52.83 12.05,53.59 12.05,60.45 | 12.05,60.45 J15.2 | R78.1 11.03,59.69 11.8,60.45 12.05,60.45 | R79.2 13.07,59.69 12.3,60.45 12.05,60.45
N$34
  Top 0.305: R65.1 R63.1
  Top 0.406: JP19.2 R65.1
N$35
  Top 0.305: IC8.7 IC8.6 41.1,17.44 R68.2
N$36
  Top 0.406: IC8.5 42.4,16.13 42.78,15.75 42.78,14.14 D6.3 41.6,10.67 R69.2
N$37
  Top 0.406: JP20.2 R67.1 R69.1
N$38
  Top 0.305: IC9.3 28.81,52.07 29.32,51.56 31.1,51.56 33.89,54.36 BT1.PWR@1
N$39
  Top 0.305: R75.1 32.97,43.52 32.62,43.18 29.83,43.18 29.31,43.7 IC9.9
N$41
  Top 0.305: S1.2 28.31,51.72 IC9.4
N$43
  Top 0.406: J16.2 22.46,60.45 | 22.46,60.45 22.46,57.91 12.3,47.75 JP24.2 | R76.1 21.7,59.69 22.46,60.45 | R77.2 23.23,59.69 22.46,60.45
OD_LAMP_AUTO_P
  Top 0.61: J13.1 77.84,11.43 77.84,14.48 77.33,14.99 JP9.2
OD_LAMP_P
  Top 0.61: JP2.2 80.63,44.7 81.39,45.47 J6.4
OIL_PRESS_SW_N
  Top 0.61: JP1.2 82.66,39.88 83.25,40.47 J6.5
OUT1
  Top 0.305: IC3.21 45.65,40.46 46.09,40.89 54.81,40.89 R19.1 57.16,40.73 OK1.15
OUT2
  Top 0.305: IC3.22 45,40.57 46.09,41.66 53.45,41.66 53.71,41.91 53.71,42.93 54.38,43.6 R22.1 57.49,43.6 OK1.14
OUT3
  Top 0.305: IC3.23 44.35,40.68 46.09,42.42 52.94,42.42 53.2,42.67 53.2,50.55 53.54,50.89 R27.1 57.16,50.89 OK1.11
OUT4
  Top 0.305: IC3.24 43.7,41.05 45.83,43.18 52.18,43.18 52.44,43.43 52.44,53.09 53.36,54.01 R28.1 55.14,53.85 OK1.10
OUT5  (via drill 0.5)
  Top 0.305: IC3.28 41.01,39.28 41.01,42.42 45.07,46.48 48.12,46.48 50.91,49.28 v50.91,49.53
  Bottom 0.305: v50.91,49.53 53.2,51.82 53.2,52.83 54.38,54.01 R31.1 55.14,53.85 OK2.15
OUT6  (via drill 0.5)
  Top 0.305: IC3.27 41.77,39.2 41.77,42.16 45.32,45.72 48.88,45.72 v50.91,47.75
  Bottom 0.305: v50.91,47.75 54.05,50.89 R34.1 | 55.14,51.05 57.01,51.05
  Bottom 0.406: R34.1 55.14,51.05 | 57.01,51.05 57.26,51.31 OK2.14
OUT7  (via drill 0.5)
  Top 0.305: IC3.26 42.4,41.78 45.58,44.96 49.9,44.96 v50.91,45.97
  Bottom 0.305: v50.91,45.97 51.93,45.97 54.21,43.69 54.89,43.69 R39.1 57.49,43.6 OK2.11
OUT8  (via drill 0.5)
  Top 0.305: IC3.25 43.04,41.4 45.83,44.2 v50.91,44.2
  Bottom 0.305: v50.91,44.2 54.38,40.73 R40.1 57.16,40.73 OK2.10
OUT9
  Top 0.305: OK3.15 57.67,15.84 R43.1 51.59,15.84 41.1,26.32 IC3.1
OUT10
  Top 0.305: IC3.2 41.77,31.92 41.77,26.67 49.73,18.71 R46.1 57.67,18.71 OK3.14
OUT11
  Top 0.305: IC3.3 42.4,27.82 44.22,26 R51.1 57.67,26 OK3.11
OUT12
  Top 0.305: IC3.4 43.04,31.92 43.04,29.72 43.89,28.87 R52.1 57.67,28.87 OK3.10
PARKING_BRAKE_N
  Top 0.61: J7.2 85.96,14.86 85.96,22.61 83.68,24.89 JP11.2
SCL  (via drill 0.5)
  Top 0.305: v45.58,34.8 47.86,34.8 48.25,34.41 IC3.12 | IC9.7 28.31,48.54 28.31,43.18 29.58,41.91 31.61,41.91 36.94,36.58 v36.94,34.8
  Bottom 0.305: J1.5 5.64,13.72 7.22,13.72 12.3,18.8 12.3,34.29 12.81,34.8 v36.94,34.8 v45.58,34.8
SDA  (via drill 0.5)
  Top 0.305: IC3.13 48.88,31.95 48.88,35.31 v48.63,35.56 | IC9.6 27.8,48.53 27.8,42.67 29.32,41.15 31.35,41.15 35.93,36.58 v35.93,34.04
  Bottom 0.305: J1.3 13.07,18.35 13.07,33.78 13.32,34.04 v35.93,34.04 46.59,34.04 48.12,35.56 v48.63,35.56
SENSOR1_IN
  Top 0.305: J2.2 13.88,2.08
  Top 0.406: 13.88,2.08 JP13.1
SENSOR2_IN
  Top 0.305: J3.2 19.47,2.34
  Top 0.406: 19.47,2.34 JP14.1
SENSOR3_IN
  Top 0.305: 25.05,2.08 J4.2
  Top 0.406: JP15.1 25.05,2.08
SENSOR4_IN
  Top 0.305: 30.59,6.55 JP16.1
  Top 0.406: J5.2 30.59,6.55
SENSOR5_IN
  Top 0.305: 36.18,6.55 JP19.1
  Top 0.406: J10.2 36.18,6.55
SENSOR6_IN
  Top 0.406: J8.2 44.36,2.08 JP20.1
SIG_3V3_IN1  (via drill 0.5)
  Top 0.305: IC2.7 32.37,29.43 v32.37,27.43
  Bottom 0.305: v32.37,27.43 35.67,24.13 36.69,24.13 37.7,23.11 52.18,23.11 53.07,22.23 IC6.1
  Bottom 0.406: R56.2 53.07,18.25 IC6.1
SIG_3V3_IN2  (via drill 0.5)
  Top 0.305: IC2.8 33.89,29.43 v33.89,27.43
  Bottom 0.305: v33.89,27.43 36.43,24.89 36.94,24.89 37.96,23.88 51.17,23.88 51.8,24.51 IC6.7
  Bottom 0.406: R62.2 52.18,28.28 52.18,27.69 51.8,27.3 IC6.7
SPI_CE0_N
  Top 0.305: J1.24 3.28,36.44 4.58,37.72 7.88,37.72 8.19,38.05 JP22.3
SPI_CE1_N
  Top 0.305: J1.26 3.28,38.98 4.43,40.26 7.48,40.26 7.93,39.67 JP22.1
SPI_CLK
  Top 0.305: J1.23 8.67,32.26 27.29,32.26 28.69,33.66 IC2.13
SPI_MISO
  Top 0.305: J1.21 5.62,33.78 6.72,33.78 8.24,31.75 27.8,31.75 29.96,33.91 IC2.12
SPI_MOSI
  Top 0.305: J1.19 5.38,31.24 28.31,31.24 31.23,34.16 IC2.11

### Text on the board
tPlace: +3.3V | VSS | GND | +3.3V | TACH | GND
tNames: Volvo 240 Pi Dash Adapter / Rev A. Dec 2021 / @whitfijs